# EAGLE schematic BaseBoard5 (EAGLE 6.5.0)

## Sheet 1 of 3: Power Supply
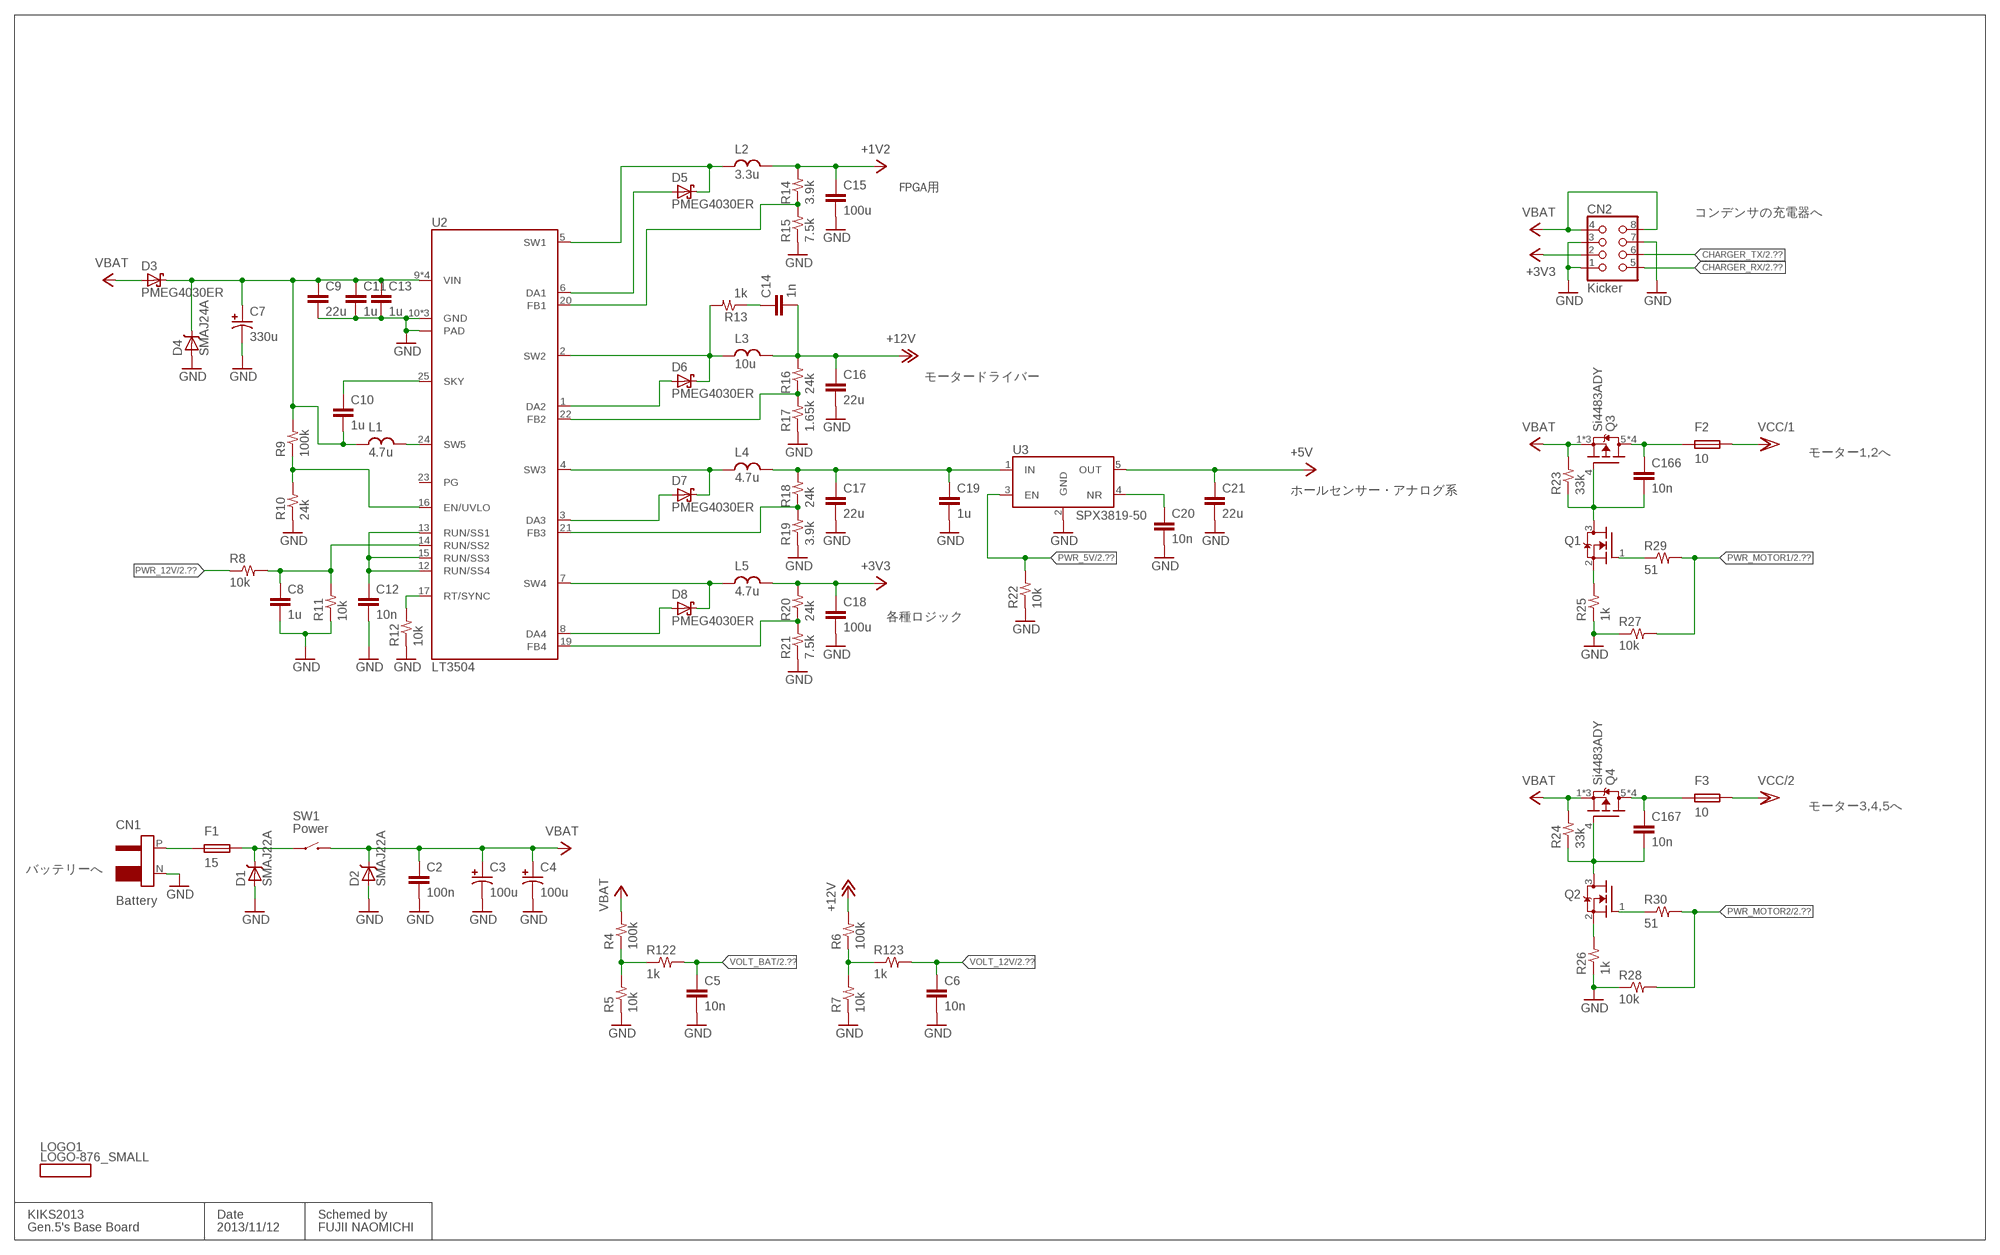
[diagram p0: schematic, sheet 1]

### Parts
C2  100n  C1608  [1608]
C3  100u  CPOLS-6.3  [ES-6.3]
C4  100u  CPOLS-6.3  [ES-6.3]
C5  10n  C1005  [1005]
C6  10n  C1005  [1005]
C7  330u  CPOLS2-8  [ES2-8]
C8  1u  C1005  [1005]
C9  22u  C3225  [3225]
C10  1u  C1608  [1608]
C11  1u  C1608  [1608]
C12  10n  C1005  [1005]
C13  1u  C1608  [1608]
C14  1n  C1005  [1005]
C15  100u  C3225  [3225]
C16  22u  C3225  [3225]
C17  22u  C3216  [3216]
C18  100u  C3225  [3225]
C19  1u  C1005  [1005]
C20  10n  C1005  [1005]
C21  22u  C3216  [3216]
C166  10n  C1005  [1005]
C167  10n  C1005  [1005]
CN1  Battery  T-CON  [T-CON]
CN2  Kicker  43045-0800  [43045-0800]
D1  SMAJ22A  ZENER-DO-214AC  [DO-214AC]
D2  SMAJ22A  ZENER-DO-214AC  [DO-214AC]
D3  PMEG4030ER  SBD-SDO123W  [SOD123W]
D4  SMAJ24A  ZENER-DO-214AC  [DO-214AC]
D5  PMEG4030ER  SBD-SDO123W  [SOD123W]
D6  PMEG4030ER  SBD-SDO123W  [SOD123W]
D7  PMEG4030ER  SBD-SDO123W  [SOD123W]
D8  PMEG4030ER  SBD-SDO123W  [SOD123W]
F1  15  F3216  [3216]
F2  10  F3216  [3216]
F3  10  F3216  [3216]
L1  4.7u  L2520  [L2520]
L2  3.3u  L2520  [L2520]
L3  10u  L40  [L4040]
L4  4.7u  L2520  [L2520]
L5  4.7u  L2520  [L2520]
LOGO1  LOGO-876_SMALL  [LOGO-876_SMALL]
Q1  MOS-N-SOT23  [SOT23-3]
Q2  MOS-N-SOT23  [SOT23-3]
Q3  Si4483ADY  MOS-P-SOP8  [SOP8]
Q4  Si4483ADY  MOS-P-SOP8  [SOP8]
R4  100k  R1608  [1608]
R5  10k  R1608  [1608]
R6  100k  R1608  [1608]
R7  10k  R1608  [1608]
R8  10k  R1005  [1005]
R9  100k  R1608  [1608]
R10  24k  R1608  [1608]
R11  10k  R1005  [1005]
R12  10k  R1005  [1005]
R13  1k  R1005  [1005]
R14  3.9k  R1608  [1608]
R15  7.5k  R1608  [1608]
R16  24k  R1608  [1608]
R17  1.65k  R1608  [1608]
R18  24k  R1608  [1608]
R19  3.9k  R1608  [1608]
R20  24k  R1608  [1608]
R21  7.5k  R1608  [1608]
R22  10k  R1005  [1005]
R23  33k  R1005  [1005]
R24  33k  R1005  [1005]
R25  1k  R1005  [1005]
R26  1k  R1005  [1005]
R27  10k  R1005  [1005]
R28  10k  R1005  [1005]
R29  51  R1005  [1005]
R30  51  R1005  [1005]
R122  1k  R1005  [1005]
R123  1k  R1005  [1005]
SW1  Power  SLE6A4  [SLE6_10A4]
U2  LT3504  [QFN28-0.5-PAD]
U3  SPX3819-50  [SOT23-5]

### Nets
+1V2: C15.1 L2.2 R14.2 ; also sheet 2
+3V3: C18.1 CN2.2 L5.2 R20.2 ; also sheet 2,3
+5V: C21.1 U3.5(OUT) ; also sheet 2,3
+12V: C14.2 C16.1 L3.2 R6.2 R16.2 ; also sheet 3
CHARGER_RX: CN2.5 ; also sheet 2
CHARGER_TX: CN2.6 ; also sheet 2
GND: C2.2 C3.N C4.N C5.2 C6.2 C7.N C8.2 C9.2 C11.2 C12.2 C13.2 C15.2 C16.2 C17.2 C18.2 C19.2 C20.2 C21.2 CN1.N CN2.1 CN2.3 CN2.7 D1.A D2.A D4.A R5.1 R7.1 R10.1 R11.1 R12.1 R15.1 R17.1 R19.1 R21.1 R22.1 R25.1 R26.1 R27.1 R28.1 U2.10(GND) U2.18(GND) U2.27(GND) U2.PAD U3.2(GND) ; also sheet 2,3
N$1: C8.1 R8.2 R11.2 U2.14(RUN/SS2)
N$3: C10.1 U2.25(SKY)
N$4: L1.2 U2.24(SW5)
N$5: C12.1 U2.12(RUN/SS4) U2.13(RUN/SS1) U2.15(RUN/SS3)
N$6: D8.A U2.8(DA4)
N$7: D7.A U2.3(DA3)
N$8: D8.K L5.1 U2.7(SW4)
N$9: R12.2 U2.17(RT/SYNC)
N$10: D6.A U2.1(DA2)
N$12: D5.K L2.1 U2.5(SW1)
N$13: R18.1 R19.2 U2.21(FB3)
N$14: D6.K L3.1 R13.2 U2.2(SW2)
N$15: D7.K L4.1 U2.4(SW3)
N$16: R9.1 R10.2 U2.16(EN/UVLO)
N$17: R20.1 R21.2 U2.19(FB4)
N$18: R14.1 R15.2 U2.20(FB1)
N$19: R16.1 R17.2 U2.22(FB2)
N$21: C17.1 C19.1 L4.2 R18.2 U3.1(IN)
N$23: C166.1 F2.1 Q3.5(D) Q3.6(D) Q3.7(D) Q3.8(D)
N$25: C166.2 Q1.3(D) Q3.4(G) R23.1
N$26: C14.1 R13.1
N$31: C7.P C9.1 C10.2 C11.1 C13.1 D3.K D4.K L1.1 R9.2 U2.9(VIN) U2.11(VIN) U2.26(VIN) U2.28(VIN)
N$36: Q1.2(S) R25.2
N$39: C167.1 F3.1 Q4.5(D) Q4.6(D) Q4.7(D) Q4.8(D)
N$44: D5.A U2.6(DA1)
N$45: C167.2 Q2.3(D) Q4.4(G) R24.1
N$46: Q2.1(G) R30.1
N$47: Q1.1(G) R29.1
N$60: C20.1 U3.4(NR)
N$89: CN1.P F1.1
N$170: Q2.2(S) R26.2
N$172: D1.K F1.2 SW1.P(A)
N$175: R4.1 R5.2 R122.1
N$176: R6.1 R7.2 R123.1
PWR_5V: R22.2 U3.3(EN) ; also sheet 2
PWR_12V: R8.1 ; also sheet 2
PWR_MOTOR1: R27.2 R29.2 ; also sheet 2
PWR_MOTOR2: R28.2 R30.2 ; also sheet 2
VBAT: C2.1 C3.P C4.P CN2.4 CN2.8 D2.K D3.A Q3.1(S) Q3.2(S) Q3.3(S) Q4.1(S) Q4.2(S) Q4.3(S) R4.2 R23.2 R24.2 SW1.1(B)
VCC/1: F2.2 ; also sheet 3
VCC/2: F3.2 ; also sheet 3
VOLT_12V: C6.1 R123.2 ; also sheet 2
VOLT_BAT: C5.1 R122.2 ; also sheet 2
Unconnected: U2.23(PG)

### Notes on the sheet
- FPGA用
- コンデンサの充電器へ
- モータードライバー
- モーター1,2へ
- ホールセンサー・アナログ系
- 各種ロジック
- モーター3,4,5へ
- バッテリーへ
- KIKS2013 | Date | Schemed by
- Gen.5's Base Board | 2013/11/12 | FUJII NAOMICHI

## Sheet 2 of 3: Logic
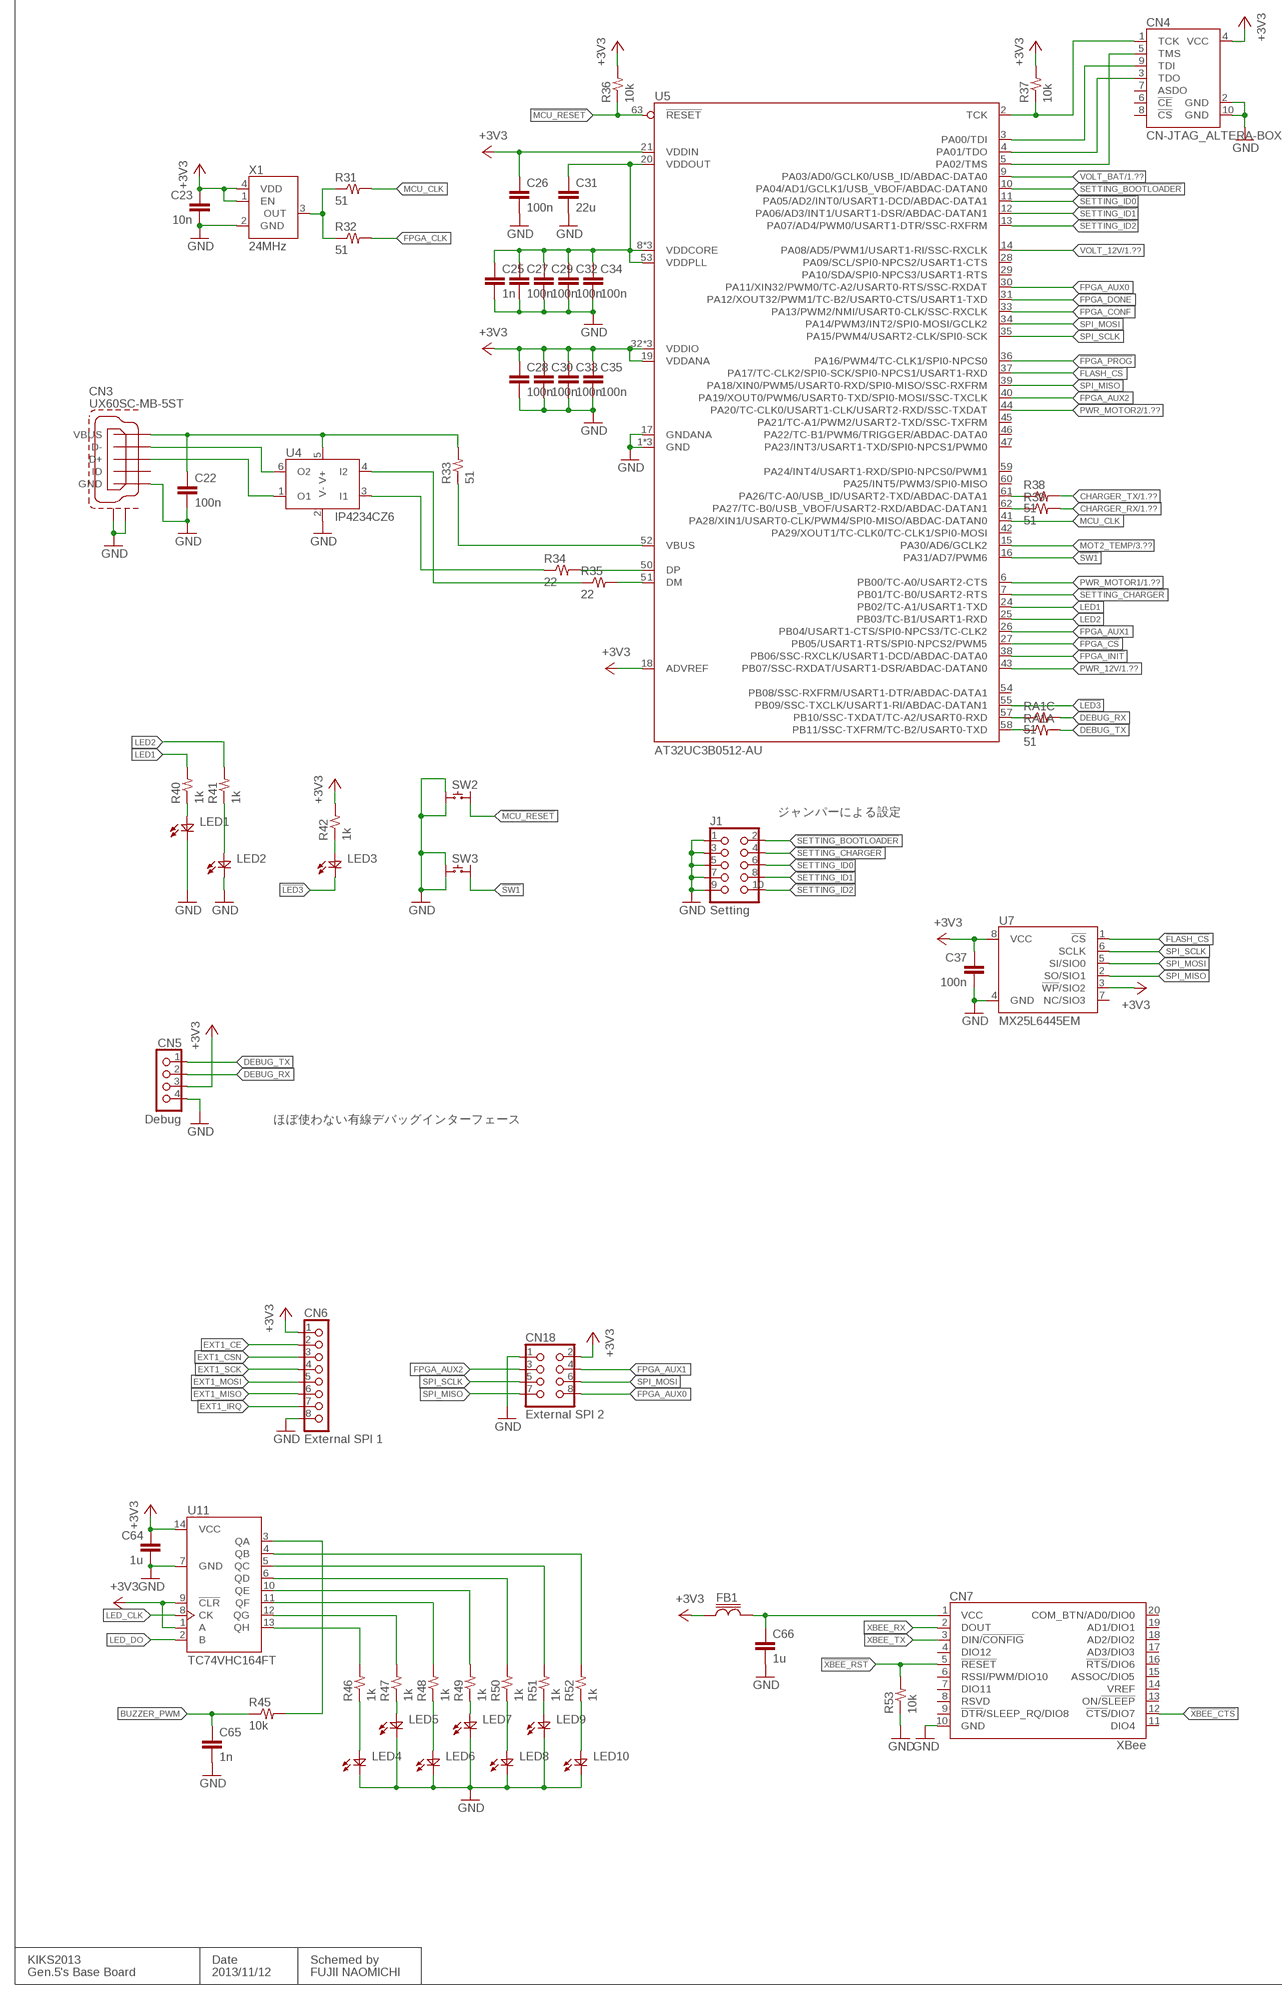
[diagram p1: schematic, sheet 2, part 1 of 2]
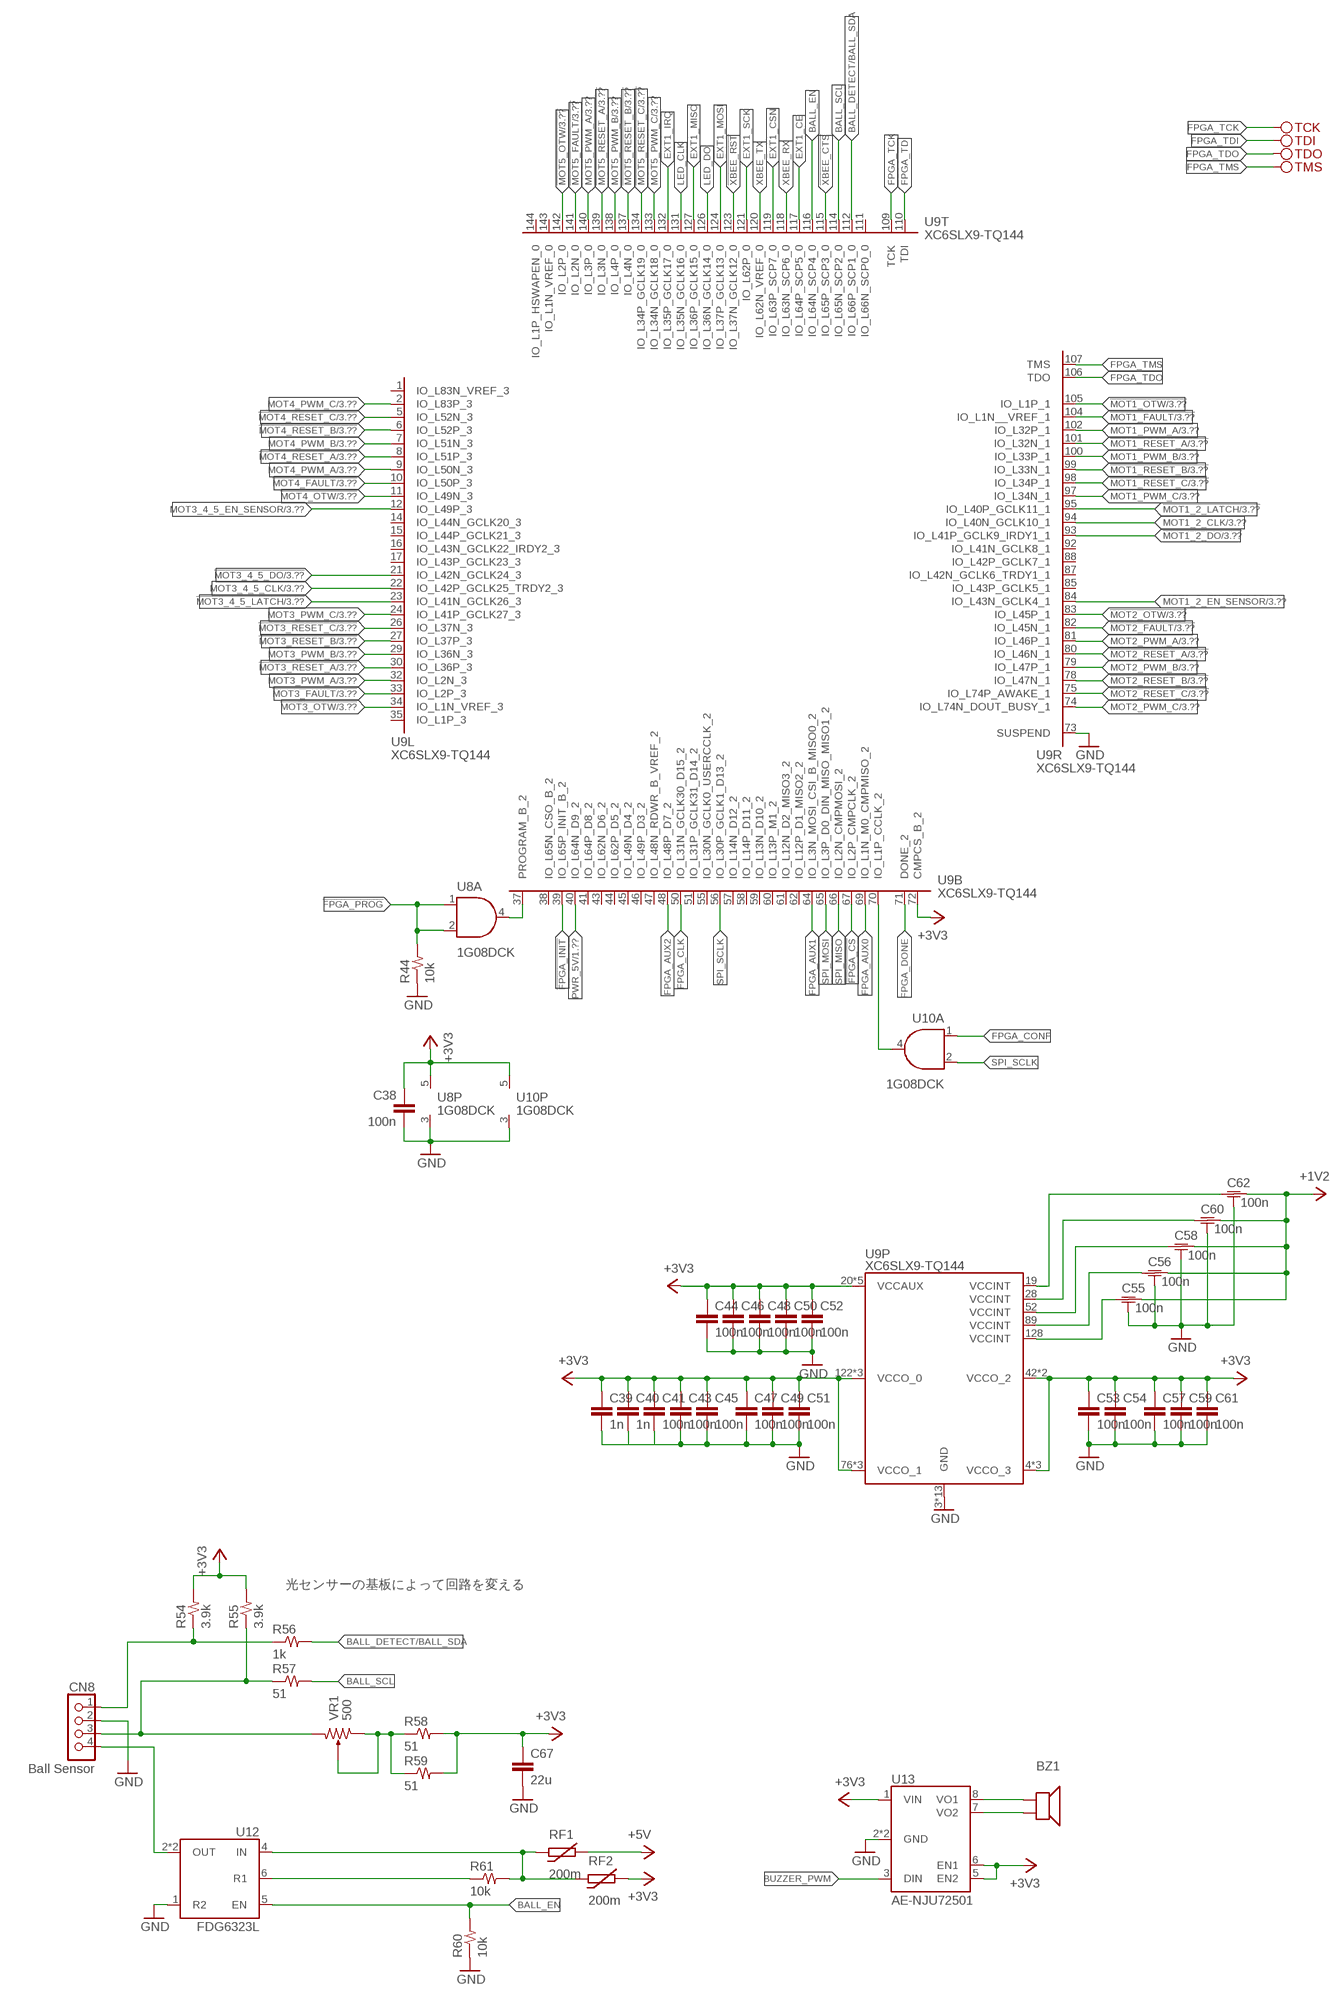
[diagram p2: schematic, sheet 2, part 2 of 2]

### Parts
BZ1  PKLCS1212E4001  [PKLCS1212]
C22  100n  C1005  [1005]
C23  10n  C1005  [1005]
C25  1n  C1005  [1005]
C26  100n  C1005  [1005]
C27  100n  C1005  [1005]
C28  100n  C1005  [1005]
C29  100n  C1005  [1005]
C30  100n  C1005  [1005]
C31  22u  C2012  [2012]
C32  100n  C1005  [1005]
C33  100n  C1005  [1005]
C34  100n  C1005  [1005]
C35  100n  C1005  [1005]
C37  100n  C1005  [1005]
C38  100n  C1005  [1005]
C39  1n  C1005  [1005]
C40  1n  C1005  [1005]
C41  100n  C1005  [1005]
C43  100n  C1005  [1005]
C44  100n  C1005  [1005]
C45  100n  C1005  [1005]
C46  100n  C1005  [1005]
C47  100n  C1005  [1005]
C48  100n  C1005  [1005]
C49  100n  C1005  [1005]
C50  100n  C1005  [1005]
C51  100n  C1005  [1005]
C52  100n  C1005  [1005]
C53  100n  C1005  [1005]
C54  100n  C1005  [1005]
C55  100n  CT1608  [NFM18]
C56  100n  CT1608  [NFM18]
C57  100n  C1005  [1005]
C58  100n  CT1608  [NFM18]
C59  100n  C1005  [1005]
C60  100n  CT1608  [NFM18]
C61  100n  C1005  [1005]
C62  100n  CT1608  [NFM18]
C64  1u  C1005  [1005]
C65  1n  C1005  [1005]
C66  1u  C1608  [1608]
C67  22u  C2012  [2012]
CN3  UX60SC-MB-5ST  [UX60SC-MB-5ST]
CN4  CN-JTAG_ALTERA-BOX  [PIN2X5-BOX]
CN5  Debug  70553-0003  [70553-0003]
CN6  External SPI 1  PIN1X8  [PIN1X8]
CN7  XBee  XBEE-TH  [XBEE-TH]
CN8  Ball Sensor  53375-0410  [53375-04]
CN18  External SPI 2  PIN2X4  [PIN2X4]
FB1  FB1608  [1608]
J1  Setting  PIN2X5-2.0  [PIN2X5-2.0]
LED1  LED1608  [1608]
LED2  LED1608  [1608]
LED3  LED1608  [1608]
LED4  LED1608  [1608]
LED5  LED1608  [1608]
LED6  LED1608  [1608]
LED7  LED1608  [1608]
LED8  LED1608  [1608]
LED9  LED1608  [1608]
LED10  LED1608  [1608]
P1  TCK  PAD  [PAD]
P2  TDI  PAD  [PAD]
P3  TDO  PAD  [PAD]
P4  TMS  PAD  [PAD]
R31  51  R1005  [1005]
R32  51  R1005  [1005]
R33  51  R1005  [1005]
R34  22  R1005  [1005]
R35  22  R1005  [1005]
R36  10k  R1005  [1005]
R37  10k  R1005  [1005]
R38  51  R1005  [1005]
R39  51  R1005  [1005]
R40  1k  R1005  [1005]
R41  1k  R1005  [1005]
R42  1k  R1005  [1005]
R44  10k  R1005  [1005]
R45  10k  R1005  [1005]
R46  1k  R1005  [1005]
R47  1k  R1005  [1005]
R48  1k  R1005  [1005]
R49  1k  R1005  [1005]
R50  1k  R1005  [1005]
R51  1k  R1005  [1005]
R52  1k  R1005  [1005]
R53  10k  R1005  [1005]
R54  3.9k  R1608  [1608]
R55  3.9k  R1608  [1608]
R56  1k  R1005  [1005]
R57  51  R1005  [1005]
R58  51  R1005  [1005]
R59  51  R1005  [1005]
R60  10k  R1005  [1005]
R61  10k  R1005  [1005]
RA1  51  RA4  [1005-A4]
RF1  200m  RF2012  [2012]
RF2  200m  RF2012  [2012]
SW2  EVQ-P2-RECTANGLE  [EVQ-P2_P9]
SW3  EVQ-P2-RECTANGLE  [EVQ-P2_P9]
U4  IP4234CZ6  TPD2S017  [SOT23-6]
U5  AT32UC3B0512-AU  [QFP64-0.5]
U7  MX25L6445EM  [SOP8W]
U8  1G08DCK  [SC70-5]
U9  XC6SLX9-TQ144  [QFP144-0.5]
U10  1G08DCK  [SC70-5]
U11  TC74VHC164FT  [TSSOP14]
U12  FDG6323L  [SC70-6]
U13  AE-NJU72501  [AE-NJU72501]
VR1  500  VR  [VR]
X1  24MHz  ASDMB  [OSC2520]

### Nets
!FLASH_CS: U5.37(PA17/TC-CLK2/SPI0-SCK/SPI0-NPCS1/USART1-RXD) U7.1(!CS)
!FPGA_CS: U5.27(PB05/USART1-RTS/SPI0-NPCS2/PWM5) U9.67(B:IO_L2P_CMPCLK_2)
!FPGA_INIT: U5.38(PB06/SSC-RXCLK/USART1-DCD/ABDAC-DATA0) U9.39(B:IO_L65P_INIT_B_2)
!FPGA_PROG: R44.2 U5.36(PA16/PWM4/TC-CLK1/SPI0-NPCS0) U8.1(A:A) U8.2(A:B)
!LED3: LED3.K U5.55(PB09/SSC-TXCLK/USART1-RI/ABDAC-DATAN1)
!MCU_RESET: R36.1 SW2.B2 U5.63(!RESET)
!MOT1_2_DO: U9.93(R:IO_L41P_GCLK9_IRDY1_1) ; also sheet 3
!MOT1_2_LATCH: U9.95(R:IO_L40P_GCLK11_1) ; also sheet 3
!MOT1_FAULT: U9.104(R:IO_L1N__VREF_1) ; also sheet 3
!MOT1_OTW: U9.105(R:IO_L1P_1) ; also sheet 3
!MOT1_RESET_A: U9.101(R:IO_L32N_1) ; also sheet 3
!MOT1_RESET_B: U9.99(R:IO_L33N_1) ; also sheet 3
!MOT1_RESET_C: U9.98(R:IO_L34P_1) ; also sheet 3
!MOT2_FAULT: U9.82(R:IO_L45N_1) ; also sheet 3
!MOT2_OTW: U9.83(R:IO_L45P_1) ; also sheet 3
!MOT2_RESET_A: U9.80(R:IO_L46N_1) ; also sheet 3
!MOT2_RESET_B: U9.78(R:IO_L47N_1) ; also sheet 3
!MOT2_RESET_C: U9.75(R:IO_L74P_AWAKE_1) ; also sheet 3
!MOT3_4_5_DO: U9.21(L:IO_L42N_GCLK24_3) ; also sheet 3
!MOT3_4_5_LATCH: U9.23(L:IO_L41N_GCLK26_3) ; also sheet 3
!MOT3_FAULT: U9.33(L:IO_L2P_3) ; also sheet 3
!MOT3_OTW: U9.34(L:IO_L1N_VREF_3) ; also sheet 3
!MOT3_RESET_A: U9.30(L:IO_L36P_3) ; also sheet 3
!MOT3_RESET_B: U9.27(L:IO_L37P_3) ; also sheet 3
!MOT3_RESET_C: U9.26(L:IO_L37N_3) ; also sheet 3
!MOT4_FAULT: U9.10(L:IO_L50P_3) ; also sheet 3
!MOT4_OTW: U9.11(L:IO_L49N_3) ; also sheet 3
!MOT4_RESET_A: U9.8(L:IO_L51P_3) ; also sheet 3
!MOT4_RESET_B: U9.6(L:IO_L52P_3) ; also sheet 3
!MOT4_RESET_C: U9.5(L:IO_L52N_3) ; also sheet 3
!MOT5_FAULT: U9.141(T:IO_L2N_0) ; also sheet 3
!MOT5_OTW: U9.142(T:IO_L2P_0) ; also sheet 3
!MOT5_RESET_A: U9.139(T:IO_L3N_0) ; also sheet 3
!MOT5_RESET_B: U9.137(T:IO_L4N_0) ; also sheet 3
!MOT5_RESET_C: U9.134(T:IO_L34P_GCLK19_0) ; also sheet 3
!SETTING_BOOTLOADER: J1.2 U5.10(PA04/AD1/GCLK1/USB_VBOF/ABDAC-DATAN0)
!SETTING_CHARGER: J1.4 U5.7(PB01/TC-B0/USART2-RTS)
!SETTING_ID0: J1.6 U5.11(PA05/AD2/INT0/USART1-DCD/ABDAC-DATA1)
!SETTING_ID1: J1.8 U5.12(PA06/AD3/INT1/USART1-DSR/ABDAC-DATAN1)
!SETTING_ID2: J1.10 U5.13(PA07/AD4/PWM0/USART1-DTR/SSC-RXFRM)
!SW1: SW3.B2 U5.16(PA31/AD7/PWM6)
!XBEE_CTS: CN7.12(!CTS!/DIO7) U9.115(T:IO_L65P_SCP3_0)
!XBEE_RST: CN7.5(!RESET) R53.2 U9.123(T:IO_L37N_GCLK12_0)
+1V2: C55.2 C56.2 C58.2 C60.2 C62.2 ; also sheet 1
+1V8: C25.1 C27.1 C29.1 C31.1 C32.1 C34.1 U5.8(VDDCORE) U5.20(VDDOUT) U5.22(VDDCORE) U5.53(VDDPLL) U5.56(VDDCORE)
+3V3: C23.1 C26.1 C28.1 C30.1 C33.1 C35.1 C37.1 C38.1 C39.1 C40.1 C41.1 C43.1 C44.1 C45.1 C46.1 C47.1 C48.1 C49.1 C50.1 C51.1 C52.1 C53.1 C54.1 C57.1 C59.1 C61.1 C64.1 C67.1 CN4.4(VCC) CN5.3 CN6.1 CN18.2 FB1.1 R36.2 R37.2 R42.2 R54.2 R55.2 R58.2 R59.2 RF2.2 U5.18(ADVREF) U5.19(VDDANA) U5.21(VDDIN) U5.32(VDDIO) U5.48(VDDIO) U5.64(VDDIO) U7.3(!WP!/SIO2) U7.8(VCC) U8.5(P:VCC) U9.4(P:VCCO_3) U9.18(P:VCCO_3) U9.20(P:VCCAUX) U9.31(P:VCCO_3) U9.36(P:VCCAUX) U9.42(P:VCCO_2) U9.53(P:VCCAUX) U9.63(P:VCCO_2) U9.72(B:CMPCS_B_2) U9.76(P:VCCO_1) U9.86(P:VCCO_1) U9.90(P:VCCAUX) U9.103(P:VCCO_1) U9.122(P:VCCO_0) U9.125(P:VCCO_0) U9.129(P:VCCAUX) U9.135(P:VCCO_0) U10.5(P:VCC) U11.1(A) U11.9(!CLR) U11.14(VCC) U13.1(VIN) U13.5(EN2) U13.6(EN1) X1.1(EN) X1.4(VDD) ; also sheet 1,3
+5V: RF1.2 ; also sheet 1,3
BALL_DETECT/BALL_SDA: R56.2 U9.112(T:IO_L66P_SCP1_0)
BALL_EN: R60.2 U9.116(T:IO_L64N_SCP4_0) U12.5(EN)
BALL_SCL: R57.2 U9.114(T:IO_L65N_SCP2_0)
BUZZER_PWM: C65.1 R45.1 U13.3(DIN)
CHARGER_RX: R39.2 ; also sheet 1
CHARGER_TX: R38.2 ; also sheet 1
DEBUG_RX: CN5.2 RA1.C2
DEBUG_TX: CN5.1 RA1.A2
EXT1_CE: CN6.2 U9.117(T:IO_L64P_SCP5_0)
EXT1_CSN: CN6.3 U9.119(T:IO_L63P_SCP7_0)
EXT1_IRQ: CN6.7 U9.132(T:IO_L35P_GCLK17_0)
EXT1_MISO: CN6.6 U9.127(T:IO_L36P_GCLK15_0)
EXT1_MOSI: CN6.5 U9.124(T:IO_L37P_GCLK13_0)
EXT1_SCK: CN6.4 U9.121(T:IO_L62P_0)
FPGA_AUX0: CN18.8 U5.30(PA11/XIN32/PWM0/TC-A2/USART0-RTS/SSC-RXDAT) U9.69(B:IO_L1N_M0_CMPMISO_2)
FPGA_AUX1: CN18.4 U5.26(PB04/USART1-CTS/SPI0-NPCS3/TC-CLK2) U9.64(B:IO_L3N_MOSI_CSI_B_MISO0_2)
FPGA_AUX2: CN18.3 U5.40(PA19/XOUT0/PWM6/USART0-TXD/SPI0-MOSI/SSC-TXCLK) U9.48(B:IO_L48P_D7_2)
FPGA_CLK: R32.2 U9.50(B:IO_L31N_GCLK30_D15_2)
FPGA_CONF: U5.33(PA13/PWM2/NMI/USART0-CLK/SSC-RXCLK) U10.1(A:A)
FPGA_DONE: U5.31(PA12/XOUT32/PWM1/TC-B2/USART0-CTS/USART1-TXD) U9.71(B:DONE_2)
FPGA_TCK: P1.1 U9.109(T:TCK)
FPGA_TDI: P2.1 U9.110(T:TDI)
FPGA_TDO: P3.1 U9.106(R:TDO)
FPGA_TMS: P4.1 U9.107(R:TMS)
GND: C22.2 C23.2 C25.2 C26.2 C27.2 C28.2 C29.2 C30.2 C31.2 C32.2 C33.2 C34.2 C35.2 C37.2 C38.2 C39.2 C40.2 C41.2 C43.2 C44.2 C45.2 C46.2 C47.2 C48.2 C49.2 C50.2 C51.2 C52.2 C53.2 C54.2 C55.GND C56.GND C57.2 C58.GND C59.2 C60.GND C61.2 C62.GND C64.2 C65.2 C66.2 C67.2 CN3.5(GND) CN3.S1 CN3.S2 CN4.2(GND) CN4.10(GND) CN5.4 CN6.8 CN7.10(GND) CN8.2 CN18.1 J1.1 J1.3 J1.5 J1.7 J1.9 LED1.K LED2.K LED4.K LED5.K LED6.K LED7.K LED8.K LED9.K LED10.K R44.1 R53.1 R60.1 SW2.A1 SW2.A2 SW3.A1 SW3.A2 U4.2(V-) U5.1(GND) U5.17(GNDANA) U5.23(GND) U5.49(GND) U7.4(GND) U8.3(P:GND) U9.3(P:GND) U9.13(P:GND) U9.25(P:GND) U9.49(P:GND) U9.54(P:GND) U9.68(P:GND) U9.73(R:SUSPEND) U9.77(P:GND) U9.91(P:GND) U9.96(P:GND) U9.108(P:GND) U9.113(P:GND) U9.130(P:GND) U9.136(P:GND) U10.3(P:GND) U11.7(GND) U12.1(R2) U13.2(GND) U13.4(GND) X1.2(GND) ; also sheet 1,3
LED1: R40.2 U5.24(PB02/TC-A1/USART1-TXD)
LED2: R41.2 U5.25(PB03/TC-B1/USART1-RXD)
LED_CLK: U9.131(T:IO_L35N_GCLK16_0) U11.8(CK)
LED_DO: U9.126(T:IO_L36N_GCLK14_0) U11.2(B)
MCU_CLK: R31.2 U5.41(PA28/XIN1/USART0-CLK/PWM4/SPI0-MISO/ABDAC-DATAN0)
MOT1_2_CLK: U9.94(R:IO_L40N_GCLK10_1) ; also sheet 3
MOT1_2_EN_SENSOR: U9.84(R:IO_L43N_GCLK4_1) ; also sheet 3
MOT1_PWM_A: U9.102(R:IO_L32P_1) ; also sheet 3
MOT1_PWM_B: U9.100(R:IO_L33P_1) ; also sheet 3
MOT1_PWM_C: U9.97(R:IO_L34N_1) ; also sheet 3
MOT2_PWM_A: U9.81(R:IO_L46P_1) ; also sheet 3
MOT2_PWM_B: U9.79(R:IO_L47P_1) ; also sheet 3
MOT2_PWM_C: U9.74(R:IO_L74N_DOUT_BUSY_1) ; also sheet 3
MOT2_TEMP: U5.15(PA30/AD6/GCLK2) ; also sheet 3
MOT3_4_5_CLK: U9.22(L:IO_L42P_GCLK25_TRDY2_3) ; also sheet 3
MOT3_4_5_EN_SENSOR: U9.12(L:IO_L49P_3) ; also sheet 3
MOT3_PWM_A: U9.32(L:IO_L2N_3) ; also sheet 3
MOT3_PWM_B: U9.29(L:IO_L36N_3) ; also sheet 3
MOT3_PWM_C: U9.24(L:IO_L41P_GCLK27_3) ; also sheet 3
MOT4_PWM_A: U9.9(L:IO_L50N_3) ; also sheet 3
MOT4_PWM_B: U9.7(L:IO_L51N_3) ; also sheet 3
MOT4_PWM_C: U9.2(L:IO_L83P_3) ; also sheet 3
MOT5_PWM_A: U9.140(T:IO_L3P_0) ; also sheet 3
MOT5_PWM_B: U9.138(T:IO_L4P_0) ; also sheet 3
MOT5_PWM_C: U9.133(T:IO_L34N_GCLK18_0) ; also sheet 3
N$2: R39.1 U5.62(PA27/TC-B0/USB_VBOF/USART2-RXD/ABDAC-DATAN1)
N$11: R34.2 U5.50(DP)
N$22: CN3.2(D-) U4.6(O2)
N$29: LED1.A R40.1
N$30: LED2.A R41.1
N$32: R35.2 U5.51(DM)
N$33: R35.1 U4.4(I2)
N$34: R34.1 U4.3(I1)
N$38: LED3.A R42.1
N$40: CN4.1(TCK) R37.1 U5.2(TCK)
N$41: C66.1 CN7.1(VCC) FB1.2
N$42: RA1.C1 U5.57(PB10/SSC-TXDAT/TC-A2/USART0-RXD)
N$48: R33.1 U5.52(VBUS)
N$50: BZ1.1 U13.8(VO1)
N$51: CN4.9(TDI) U5.3(PA00/TDI)
N$52: CN4.3(TDO) U5.4(PA01/TDO)
N$53: CN4.5(TMS) U5.5(PA02/TMS)
N$54: R31.1 R32.1 X1.3(OUT)
N$55: U8.4(A:Y) U9.37(B:PROGRAM_B_2)
N$56: U9.70(B:IO_L1P_CCLK_2) U10.4(A:Y)
N$90: BZ1.2 U13.7(VO2)
N$119: CN3.3(D+) U4.1(O1)
N$138: CN8.1 R54.1 R56.1
N$139: CN8.3 R55.1 R57.1 VR1.A
N$140: CN8.4 U12.2(OUT) U12.3(OUT)
N$141: R58.1 R59.1 VR1.B VR1.W
N$146: LED4.A R46.1
N$147: R61.1 U12.6(R1)
N$148: LED7.A R49.1
N$149: LED6.A R48.1
N$150: LED5.A R47.1
N$151: R61.2 RF1.1 RF2.1 U12.4(IN)
N$152: R47.2 U11.12(QG)
N$153: LED8.A R50.1
N$154: LED9.A R51.1
N$155: LED10.A R52.1
N$156: R48.2 U11.11(QF)
N$157: R49.2 U11.10(QE)
N$158: R46.2 U11.13(QH)
N$159: R50.2 U11.6(QD)
N$160: R51.2 U11.5(QC)
N$161: R52.2 U11.4(QB)
N$162: R45.2 U11.3(QA)
N$163: C62.1 U9.19(P:VCCINT)
N$164: C60.1 U9.28(P:VCCINT)
N$165: C58.1 U9.52(P:VCCINT)
N$166: C56.1 U9.89(P:VCCINT)
N$167: C55.1 U9.128(P:VCCINT)
N$168: RA1.A1 U5.58(PB11/SSC-TXFRM/TC-B2/USART0-TXD)
N$169: R38.1 U5.61(PA26/TC-A0/USB_ID/USART2-TXD/ABDAC-DATA1)
N$173: C22.1 CN3.1(VBUS) R33.2 U4.5(V+)
PWR_5V: U9.40(B:IO_L64N_D9_2) ; also sheet 1
PWR_12V: U5.43(PB07/SSC-RXDAT/USART1-DSR/ABDAC-DATAN0) ; also sheet 1
PWR_MOTOR1: U5.6(PB00/TC-A0/USART2-CTS) ; also sheet 1
PWR_MOTOR2: U5.44(PA20/TC-CLK0/USART1-CLK/USART2-RXD/SSC-TXDAT) ; also sheet 1
SPI_MISO: CN18.7 U5.39(PA18/XIN0/PWM5/USART0-RXD/SPI0-MISO/SSC-RXFRM) U7.2(SO/SIO1) U9.66(B:IO_L2N_CMPMOSI_2)
SPI_MOSI: CN18.6 U5.34(PA14/PWM3/INT2/SPI0-MOSI/GCLK2) U7.5(SI/SIO0) U9.65(B:IO_L3P_D0_DIN_MISO_MISO1_2)
SPI_SCLK: CN18.5 U5.35(PA15/PWM4/USART2-CLK/SPI0-SCK) U7.6(SCLK) U9.56(B:IO_L30P_GCLK1_D13_2) U10.2(A:B)
VOLT_12V: U5.14(PA08/AD5/PWM1/USART1-RI/SSC-RXCLK) ; also sheet 1
VOLT_BAT: U5.9(PA03/AD0/GCLK0/USB_ID/ABDAC-DATA0) ; also sheet 1
XBEE_RX: CN7.2(DOUT) U9.118(T:IO_L63N_SCP6_0)
XBEE_TX: CN7.3(DIN/!CONFIG) U9.120(T:IO_L62N_VREF_0)
Unconnected: CN3.4(ID) CN4.6(!CE) CN4.7(ASDO) CN4.8(!CS) CN7.4(DIO12) CN7.6(RSSI/PWM/DIO10) CN7.7(DIO11) CN7.8(RSVD) CN7.9(!DTR!/SLEEP_RQ/DIO8) CN7.11(DIO4) CN7.13(ON/!SLEEP) CN7.14(VREF) CN7.15(ASSOC/DIO5) CN7.16(!RTS!/DIO6) CN7.17(AD3/DIO3) CN7.18(AD2/DIO2) CN7.19(AD1/DIO1) CN7.20(COM_BTN/AD0/DIO0) RA1.B1 RA1.B2 RA1.D1 RA1.D2 SW2.B1 SW3.B1 U5.28(PA09/SCL/SPI0-NPCS2/USART1-CTS) U5.29(PA10/SDA/SPI0-NPCS3/USART1-RTS) U5.42(PA29/XOUT1/TC-CLK0/TC-CLK1/SPI0-MOSI) U5.45(PA21/TC-A1/PWM2/USART2-TXD/SSC-TXFRM) U5.46(PA22/TC-B1/PWM6/TRIGGER/ABDAC-DATA0) U5.47(PA23/INT3/USART1-TXD/SPI0-NPCS1/PWM0) U5.54(PB08/SSC-RXFRM/USART1-DTR/ABDAC-DATA1) U5.59(PA24/INT4/USART1-RXD/SPI0-NPCS0/PWM1) U5.60(PA25/INT5/PWM3/SPI0-MISO) U7.7(NC/SIO3) U9.1(L:IO_L83N_VREF_3) U9.14(L:IO_L44N_GCLK20_3) U9.15(L:IO_L44P_GCLK21_3) U9.16(L:IO_L43N_GCLK22_IRDY2_3) U9.17(L:IO_L43P_GCLK23_3) U9.35(L:IO_L1P_3) U9.38(B:IO_L65N_CSO_B_2) U9.41(B:IO_L64P_D8_2) U9.43(B:IO_L62N_D6_2) U9.44(B:IO_L62P_D5_2) U9.45(B:IO_L49N_D4_2) U9.46(B:IO_L49P_D3_2) U9.47(B:IO_L48N_RDWR_B_VREF_2) U9.51(B:IO_L31P_GCLK31_D14_2) U9.55(B:IO_L30N_GCLK0_USERCCLK_2) U9.57(B:IO_L14N_D12_2) U9.58(B:IO_L14P_D11_2) U9.59(B:IO_L13N_D10_2) U9.60(B:IO_L13P_M1_2) U9.61(B:IO_L12N_D2_MISO3_2) U9.62(B:IO_L12P_D1_MISO2_2) U9.85(R:IO_L43P_GCLK5_1) U9.87(R:IO_L42N_GCLK6_TRDY1_1) U9.88(R:IO_L42P_GCLK7_1) U9.92(R:IO_L41N_GCLK8_1) U9.111(T:IO_L66N_SCP0_0) U9.143(T:IO_L1N_VREF_0) U9.144(T:IO_L1P_HSWAPEN_0)

### Notes on the sheet
- ジャンパーによる設定
- ほぼ使わない有線デバッグインターフェース
- 光センサーの基板によって回路を変える
- KIKS2013 | Date | Schemed by
- Gen.5's Base Board | 2013/11/12 | FUJII NAOMICHI

## Sheet 3 of 3: Motor Driver
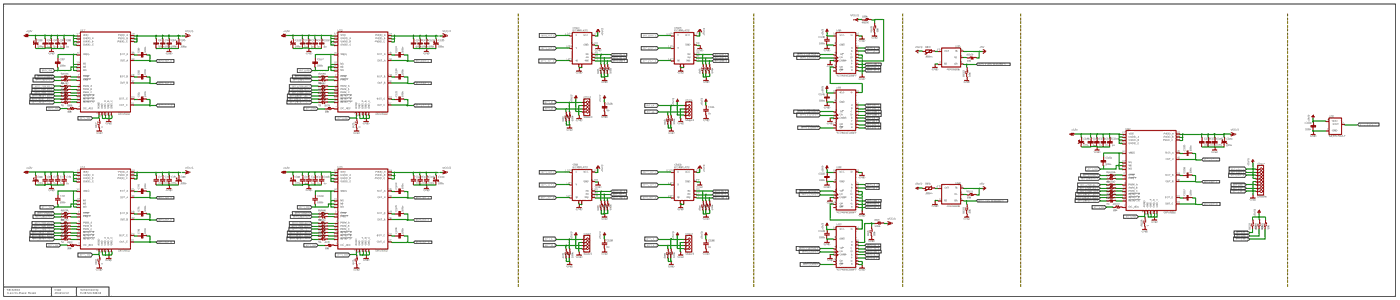
[diagram p3: schematic, sheet 3, overview]
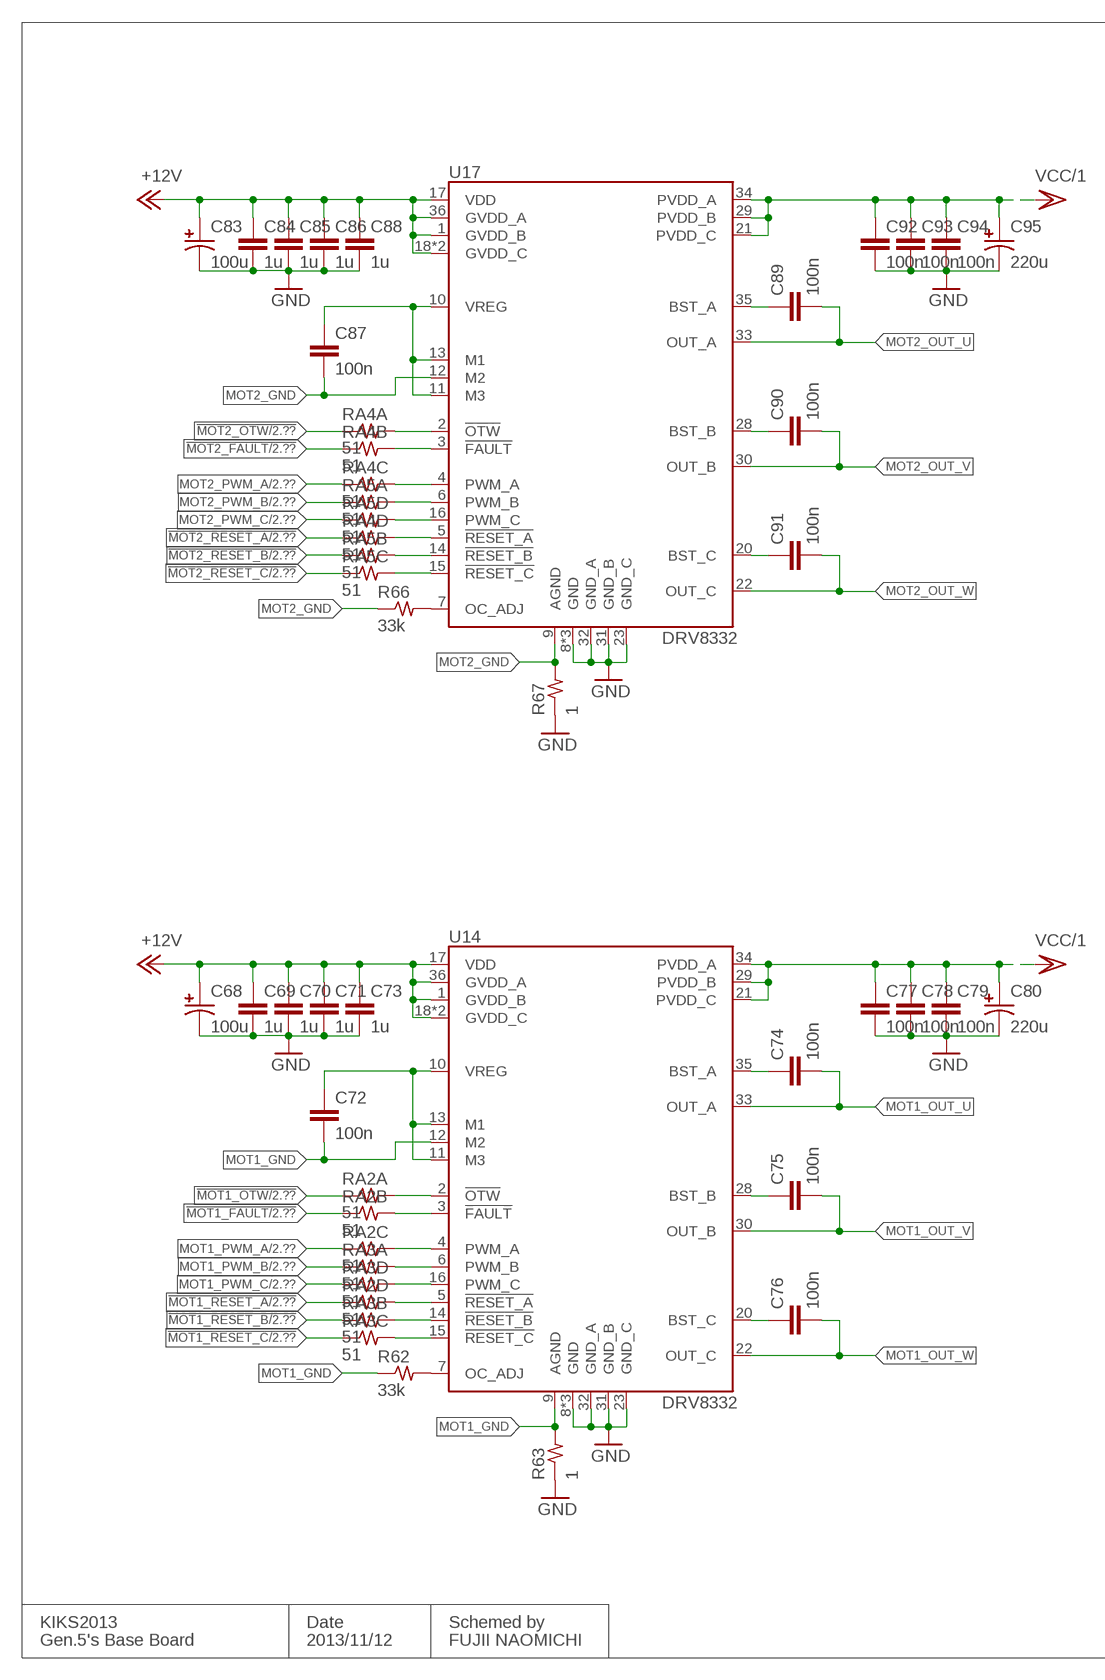
[diagram p4: schematic, sheet 3, part 1 of 4]
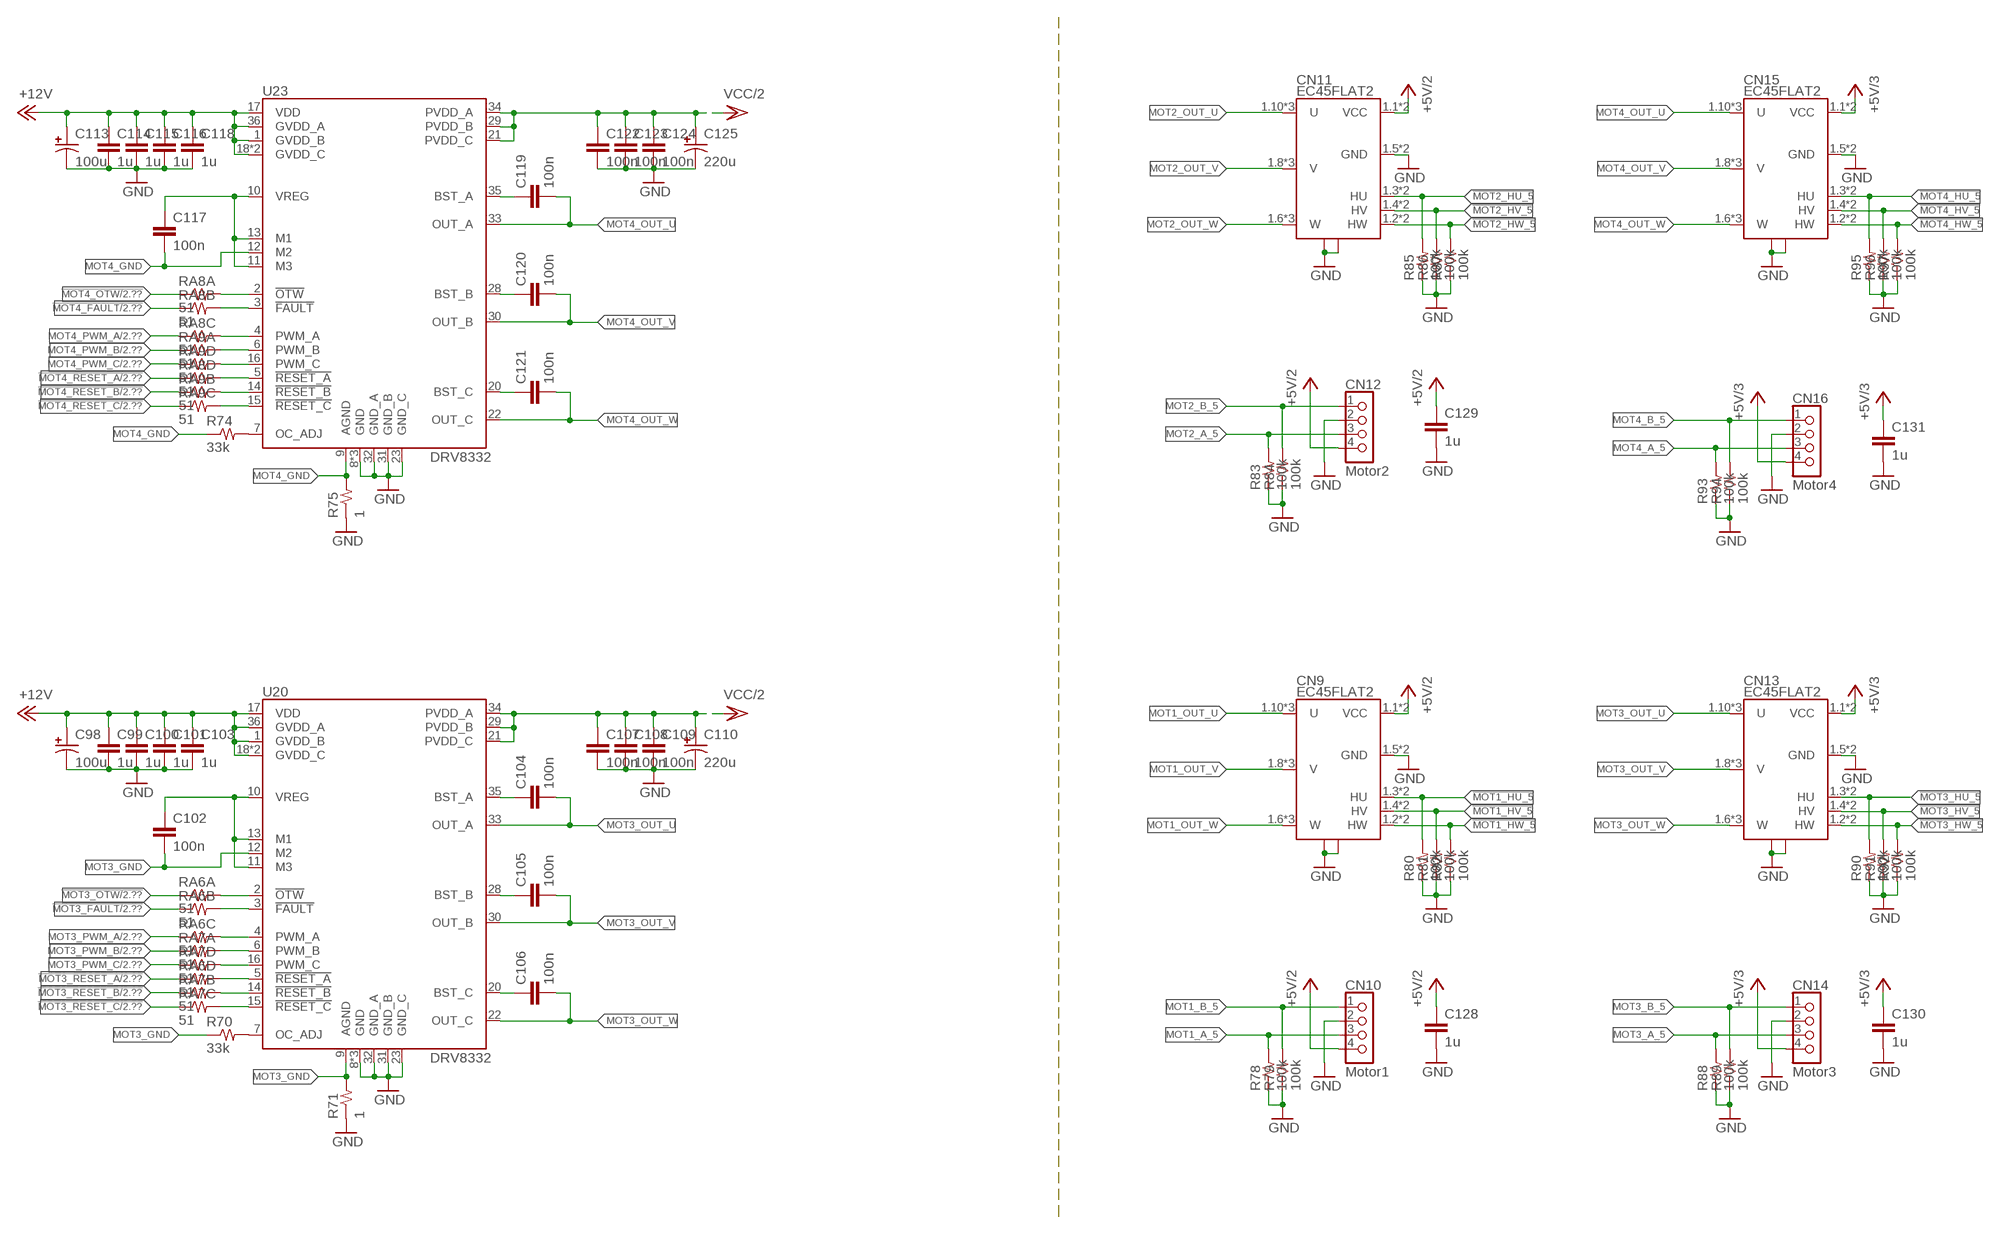
[diagram p5: schematic, sheet 3, part 2 of 4]
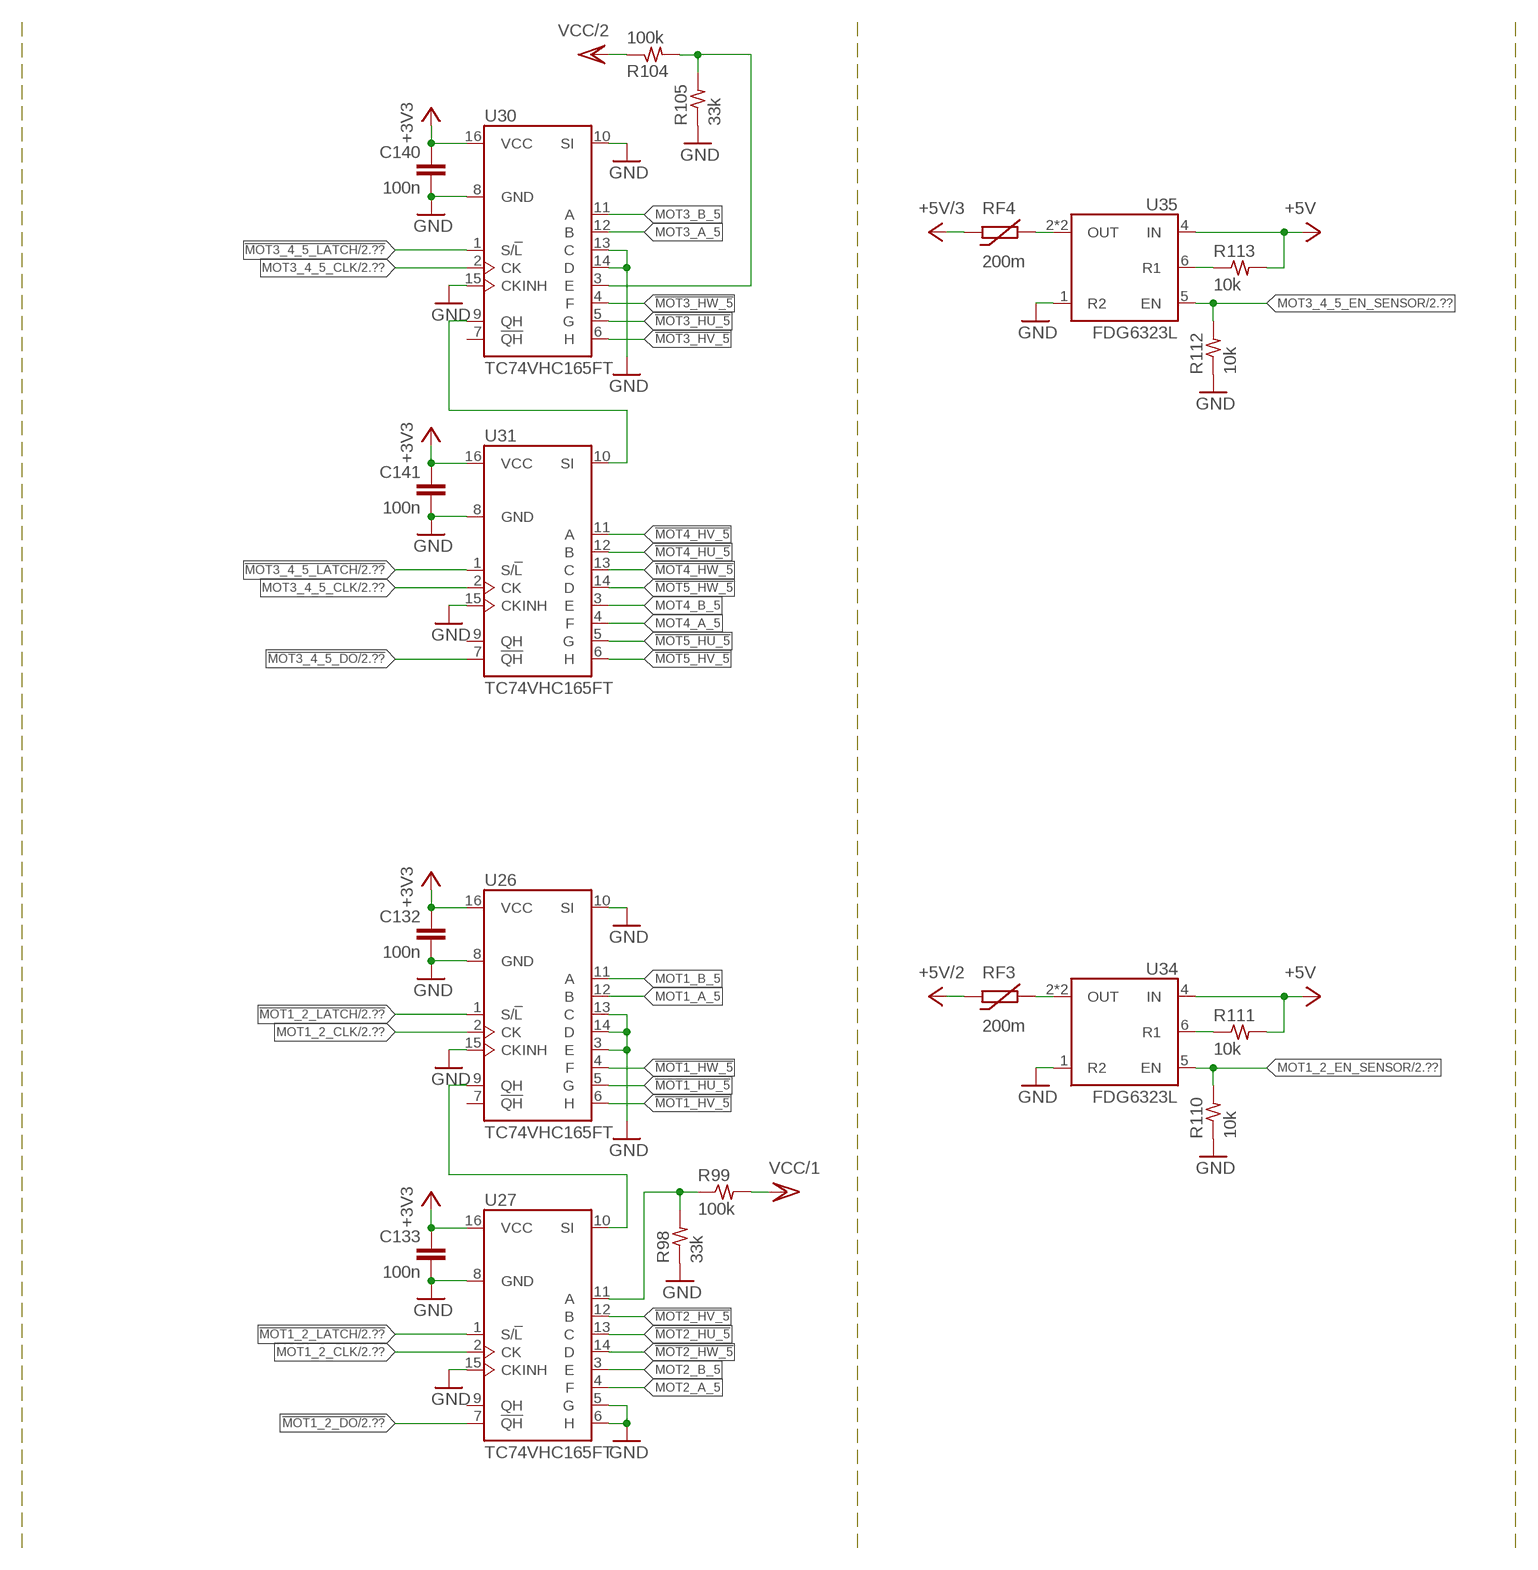
[diagram p6: schematic, sheet 3, part 3 of 4]
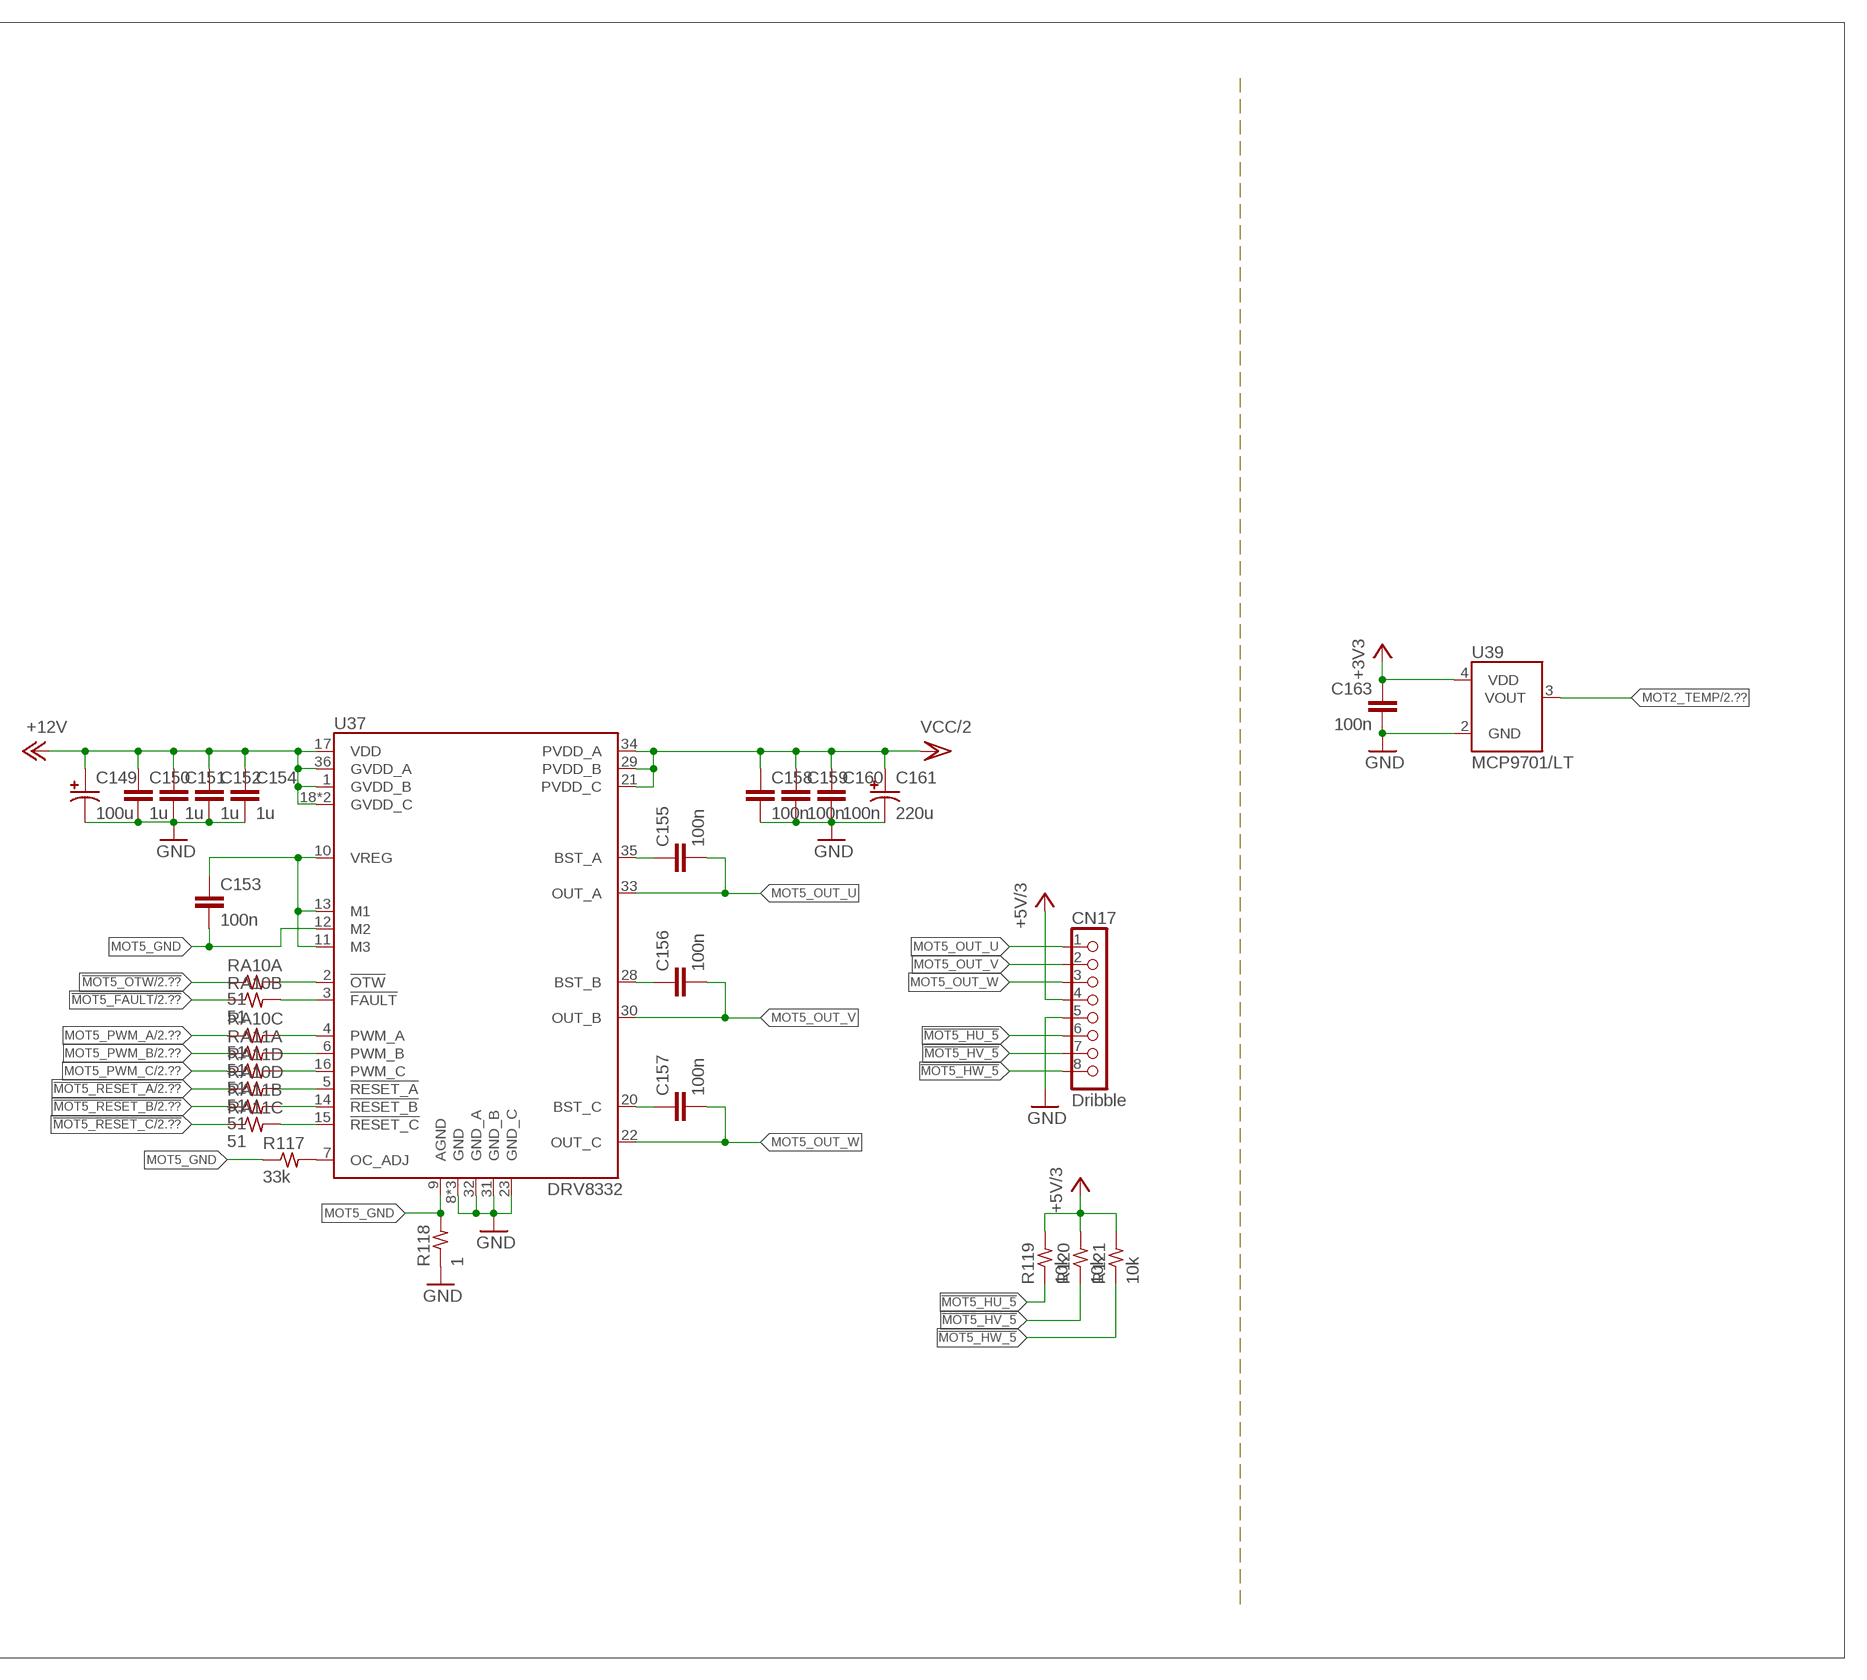
[diagram p7: schematic, sheet 3, part 4 of 4]

### Parts
C68  100u  CPOL2.5-6.3  [E2.5-6.3]
C69  1u  C1608  [1608]
C70  1u  C1608  [1608]
C71  1u  C1608  [1608]
C72  100n  C1005  [1005]
C73  1u  C1608  [1608]
C74  100n  C1608  [1608]
C75  100n  C1608  [1608]
C76  100n  C1608  [1608]
C77  100n  C1608  [1608]
C78  100n  C1608  [1608]
C79  100n  C1608  [1608]
C80  220u  CPOL3.5-8  [E3.5-8]
C83  100u  CPOL2.5-6.3  [E2.5-6.3]
C84  1u  C1608  [1608]
C85  1u  C1608  [1608]
C86  1u  C1608  [1608]
C87  100n  C1005  [1005]
C88  1u  C1608  [1608]
C89  100n  C1608  [1608]
C90  100n  C1608  [1608]
C91  100n  C1608  [1608]
C92  100n  C1608  [1608]
C93  100n  C1608  [1608]
C94  100n  C1608  [1608]
C95  220u  CPOL3.5-8  [E3.5-8]
C98  100u  CPOL2.5-6.3  [E2.5-6.3]
C99  1u  C1608  [1608]
C100  1u  C1608  [1608]
C101  1u  C1608  [1608]
C102  100n  C1005  [1005]
C103  1u  C1608  [1608]
C104  100n  C1608  [1608]
C105  100n  C1608  [1608]
C106  100n  C1608  [1608]
C107  100n  C1608  [1608]
C108  100n  C1608  [1608]
C109  100n  C1608  [1608]
C110  220u  CPOL3.5-8  [E3.5-8]
C113  100u  CPOL2.5-6.3  [E2.5-6.3]
C114  1u  C1608  [1608]
C115  1u  C1608  [1608]
C116  1u  C1608  [1608]
C117  100n  C1005  [1005]
C118  1u  C1608  [1608]
C119  100n  C1608  [1608]
C120  100n  C1608  [1608]
C121  100n  C1608  [1608]
C122  100n  C1608  [1608]
C123  100n  C1608  [1608]
C124  100n  C1608  [1608]
C125  220u  CPOL3.5-8  [E3.5-8]
C128  1u  C1005  [1005]
C129  1u  C1005  [1005]
C130  1u  C1005  [1005]
C131  1u  C1005  [1005]
C132  100n  C1005  [1005]
C133  100n  C1005  [1005]
C140  100n  C1005  [1005]
C141  100n  C1005  [1005]
C149  100u  CPOL2.5-6.3  [E2.5-6.3]
C150  1u  C1608  [1608]
C151  1u  C1608  [1608]
C152  1u  C1608  [1608]
C153  100n  C1005  [1005]
C154  1u  C1608  [1608]
C155  100n  C1608  [1608]
C156  100n  C1608  [1608]
C157  100n  C1608  [1608]
C158  100n  C1608  [1608]
C159  100n  C1608  [1608]
C160  100n  C1608  [1608]
C161  220u  CPOL3.5-8  [E3.5-8]
C163  100n  C1005  [1005]
CN9  EC45FLAT2  [MOTOR_COMPLEX2]
CN10  Motor1  53375-0410  [53375-04]
CN11  EC45FLAT2  [MOTOR_COMPLEX2]
CN12  Motor2  53375-0410  [53375-04]
CN13  EC45FLAT2  [MOTOR_COMPLEX2]
CN14  Motor3  53375-0410  [53375-04]
CN15  EC45FLAT2  [MOTOR_COMPLEX2]
CN16  Motor4  53375-0410  [53375-04]
CN17  Dribble  PIN1X8  [PIN1X8]
R62  33k  R1608  [1608]
R63  1  R1005  [1005]
R66  33k  R1608  [1608]
R67  1  R1005  [1005]
R70  33k  R1608  [1608]
R71  1  R1005  [1005]
R74  33k  R1608  [1608]
R75  1  R1005  [1005]
R78  100k  R1005  [1005]
R79  100k  R1005  [1005]
R80  100k  R1005  [1005]
R81  100k  R1005  [1005]
R82  100k  R1005  [1005]
R83  100k  R1005  [1005]
R84  100k  R1005  [1005]
R85  100k  R1005  [1005]
R86  100k  R1005  [1005]
R87  100k  R1005  [1005]
R88  100k  R1005  [1005]
R89  100k  R1005  [1005]
R90  100k  R1005  [1005]
R91  100k  R1005  [1005]
R92  100k  R1005  [1005]
R93  100k  R1005  [1005]
R94  100k  R1005  [1005]
R95  100k  R1005  [1005]
R96  100k  R1005  [1005]
R97  100k  R1005  [1005]
R98  33k  R1005  [1005]
R99  100k  R1005  [1005]
R104  100k  R1005  [1005]
R105  33k  R1005  [1005]
R110  10k  R1005  [1005]
R111  10k  R1005  [1005]
R112  10k  R1005  [1005]
R113  10k  R1005  [1005]
R117  33k  R1608  [1608]
R118  1  R1005  [1005]
R119  10k  R1005  [1005]
R120  10k  R1005  [1005]
R121  10k  R1005  [1005]
RA2  51  RA4  [1005-A4]
RA3  51  RA4  [1005-A4]
RA4  51  RA4  [1005-A4]
RA5  51  RA4  [1005-A4]
RA6  51  RA4  [1005-A4]
RA7  51  RA4  [1005-A4]
RA8  51  RA4  [1005-A4]
RA9  51  RA4  [1005-A4]
RA10  51  RA4  [1005-A4]
RA11  51  RA4  [1005-A4]
RF3  200m  RF2012  [2012]
RF4  200m  RF2012  [2012]
U14  DRV8332  [HSSOP36]
U17  DRV8332  [HSSOP36]
U20  DRV8332  [HSSOP36]
U23  DRV8332  [HSSOP36]
U26  TC74VHC165FT  [TSSOP16]
U27  TC74VHC165FT  [TSSOP16]
U30  TC74VHC165FT  [TSSOP16]
U31  TC74VHC165FT  [TSSOP16]
U34  FDG6323L  [SC70-6]
U35  FDG6323L  [SC70-6]
U37  DRV8332  [HSSOP36]
U39  MCP9701/LT  [SC70-5]

### Nets
!MOT1_2_DO: U27.7(!QH) ; also sheet 2
!MOT1_2_LATCH: U26.1(S/!L) U27.1(S/!L) ; also sheet 2
!MOT1_FAULT: RA2.B1 ; also sheet 2
!MOT1_HU_5: CN9.1.3(HU) CN9.2.2(HU) R80.2 U26.5(G)
!MOT1_HV_5: CN9.1.4(HV) CN9.2.3(HV) R81.2 U26.6(H)
!MOT1_HW_5: CN9.1.2(HW) CN9.2.4(HW) R82.2 U26.4(F)
!MOT1_OTW: RA2.A1 ; also sheet 2
!MOT1_RESET_A: RA2.D1 ; also sheet 2
!MOT1_RESET_B: RA3.B1 ; also sheet 2
!MOT1_RESET_C: RA3.C1 ; also sheet 2
!MOT2_FAULT: RA4.B1 ; also sheet 2
!MOT2_HU_5: CN11.1.3(HU) CN11.2.2(HU) R85.2 U27.13(C)
!MOT2_HV_5: CN11.1.4(HV) CN11.2.3(HV) R86.2 U27.12(B)
!MOT2_HW_5: CN11.1.2(HW) CN11.2.4(HW) R87.2 U27.14(D)
!MOT2_OTW: RA4.A1 ; also sheet 2
!MOT2_RESET_A: RA4.D1 ; also sheet 2
!MOT2_RESET_B: RA5.B1 ; also sheet 2
!MOT2_RESET_C: RA5.C1 ; also sheet 2
!MOT3_4_5_DO: U31.7(!QH) ; also sheet 2
!MOT3_4_5_LATCH: U30.1(S/!L) U31.1(S/!L) ; also sheet 2
!MOT3_FAULT: RA6.B1 ; also sheet 2
!MOT3_HU_5: CN13.1.3(HU) CN13.2.2(HU) R90.2 U30.5(G)
!MOT3_HV_5: CN13.1.4(HV) CN13.2.3(HV) R91.2 U30.6(H)
!MOT3_HW_5: CN13.1.2(HW) CN13.2.4(HW) R92.2 U30.4(F)
!MOT3_OTW: RA6.A1 ; also sheet 2
!MOT3_RESET_A: RA6.D1 ; also sheet 2
!MOT3_RESET_B: RA7.B1 ; also sheet 2
!MOT3_RESET_C: RA7.C1 ; also sheet 2
!MOT4_FAULT: RA8.B1 ; also sheet 2
!MOT4_HU_5: CN15.1.3(HU) CN15.2.2(HU) R95.2 U31.12(B)
!MOT4_HV_5: CN15.1.4(HV) CN15.2.3(HV) R96.2 U31.11(A)
!MOT4_HW_5: CN15.1.2(HW) CN15.2.4(HW) R97.2 U31.13(C)
!MOT4_OTW: RA8.A1 ; also sheet 2
!MOT4_RESET_A: RA8.D1 ; also sheet 2
!MOT4_RESET_B: RA9.B1 ; also sheet 2
!MOT4_RESET_C: RA9.C1 ; also sheet 2
!MOT5_FAULT: RA10.B1 ; also sheet 2
!MOT5_HU_5: CN17.6 R119.1 U31.5(G)
!MOT5_HV_5: CN17.7 R120.1 U31.6(H)
!MOT5_HW_5: CN17.8 R121.1 U31.14(D)
!MOT5_OTW: RA10.A1 ; also sheet 2
!MOT5_RESET_A: RA10.D1 ; also sheet 2
!MOT5_RESET_B: RA11.B1 ; also sheet 2
!MOT5_RESET_C: RA11.C1 ; also sheet 2
+3V3: C132.1 C133.1 C140.1 C141.1 C163.1 U26.16(VCC) U27.16(VCC) U30.16(VCC) U31.16(VCC) U39.4(VDD) ; also sheet 1,2
+5V: R111.2 R113.2 U34.4(IN) U35.4(IN) ; also sheet 1,2
+5V/2: C128.1 C129.1 CN9.1.1(VCC) CN9.2.8(VCC) CN10.4 CN11.1.1(VCC) CN11.2.8(VCC) CN12.4 RF3.1
+5V/3: C130.1 C131.1 CN13.1.1(VCC) CN13.2.8(VCC) CN14.4 CN15.1.1(VCC) CN15.2.8(VCC) CN16.4 CN17.4 R119.2 R120.2 R121.2 RF4.1
+12V: C68.P C69.1 C70.1 C71.1 C73.1 C83.P C84.1 C85.1 C86.1 C88.1 C98.P C99.1 C100.1 C101.1 C103.1 C113.P C114.1 C115.1 C116.1 C118.1 C149.P C150.1 C151.1 C152.1 C154.1 U14.1(GVDD_B) U14.17(VDD) U14.18(GVDD_C) U14.19(GVDD_C) U14.36(GVDD_A) U17.1(GVDD_B) U17.17(VDD) U17.18(GVDD_C) U17.19(GVDD_C) U17.36(GVDD_A) U20.1(GVDD_B) U20.17(VDD) U20.18(GVDD_C) U20.19(GVDD_C) U20.36(GVDD_A) U23.1(GVDD_B) U23.17(VDD) U23.18(GVDD_C) U23.19(GVDD_C) U23.36(GVDD_A) U37.1(GVDD_B) U37.17(VDD) U37.18(GVDD_C) U37.19(GVDD_C) U37.36(GVDD_A) ; also sheet 1
GND: C68.N C69.2 C70.2 C71.2 C73.2 C77.2 C78.2 C79.2 C80.N C83.N C84.2 C85.2 C86.2 C88.2 C92.2 C93.2 C94.2 C95.N C98.N C99.2 C100.2 C101.2 C103.2 C107.2 C108.2 C109.2 C110.N C113.N C114.2 C115.2 C116.2 C118.2 C122.2 C123.2 C124.2 C125.N C128.2 C129.2 C130.2 C131.2 C132.2 C133.2 C140.2 C141.2 C149.N C150.2 C151.2 C152.2 C154.2 C158.2 C159.2 C160.2 C161.N C163.2 CN9.1.5(GND) CN9.2.1(GND) CN9.S1 CN9.S2 CN10.2 CN11.1.5(GND) CN11.2.1(GND) CN11.S1 CN11.S2 CN12.2 CN13.1.5(GND) CN13.2.1(GND) CN13.S1 CN13.S2 CN14.2 CN15.1.5(GND) CN15.2.1(GND) CN15.S1 CN15.S2 CN16.2 CN17.5 R63.1 R67.1 R71.1 R75.1 R78.1 R79.1 R80.1 R81.1 R82.1 R83.1 R84.1 R85.1 R86.1 R87.1 R88.1 R89.1 R90.1 R91.1 R92.1 R93.1 R94.1 R95.1 R96.1 R97.1 R98.1 R105.1 R110.1 R112.1 R118.1 U14.8(GND) U14.23(GND_C) U14.24(GND) U14.25(GND) U14.31(GND_B) U14.32(GND_A) U17.8(GND) U17.23(GND_C) U17.24(GND) U17.25(GND) U17.31(GND_B) U17.32(GND_A) U20.8(GND) U20.23(GND_C) U20.24(GND) U20.25(GND) U20.31(GND_B) U20.32(GND_A) U23.8(GND) U23.23(GND_C) U23.24(GND) U23.25(GND) U23.31(GND_B) U23.32(GND_A) U26.3(E) U26.8(GND) U26.10(SI) U26.13(C) U26.14(D) U26.15(CKINH) U27.5(G) U27.6(H) U27.8(GND) U27.15(CKINH) U30.8(GND) U30.10(SI) U30.13(C) U30.14(D) U30.15(CKINH) U31.8(GND) U31.15(CKINH) U34.1(R2) U35.1(R2) U37.8(GND) U37.23(GND_C) U37.24(GND) U37.25(GND) U37.31(GND_B) U37.32(GND_A) U39.2(GND) ; also sheet 1,2
MOT1_2_CLK: U26.2(CK) U27.2(CK) ; also sheet 2
MOT1_2_EN_SENSOR: R110.2 U34.5(EN) ; also sheet 2
MOT1_A_5: CN10.3 R78.2 U26.12(B)
MOT1_B_5: CN10.1 R79.2 U26.11(A)
MOT1_GND: C72.2 R62.1 R63.2 U14.9(AGND) U14.12(M2)
MOT1_OUT_U: C74.2 CN9.1.10(U) CN9.1.11(U) CN9.2.5(U) U14.33(OUT_A)
MOT1_OUT_V: C75.2 CN9.1.8(V) CN9.1.9(V) CN9.2.6(V) U14.30(OUT_B)
MOT1_OUT_W: C76.2 CN9.1.6(W) CN9.1.7(W) CN9.2.7(W) U14.22(OUT_C)
MOT1_PWM_A: RA2.C1 ; also sheet 2
MOT1_PWM_B: RA3.A1 ; also sheet 2
MOT1_PWM_C: RA3.D1 ; also sheet 2
MOT2_A_5: CN12.3 R83.2 U27.4(F)
MOT2_B_5: CN12.1 R84.2 U27.3(E)
MOT2_GND: C87.2 R66.1 R67.2 U17.9(AGND) U17.12(M2)
MOT2_OUT_U: C89.2 CN11.1.10(U) CN11.1.11(U) CN11.2.5(U) U17.33(OUT_A)
MOT2_OUT_V: C90.2 CN11.1.8(V) CN11.1.9(V) CN11.2.6(V) U17.30(OUT_B)
MOT2_OUT_W: C91.2 CN11.1.6(W) CN11.1.7(W) CN11.2.7(W) U17.22(OUT_C)
MOT2_PWM_A: RA4.C1 ; also sheet 2
MOT2_PWM_B: RA5.A1 ; also sheet 2
MOT2_PWM_C: RA5.D1 ; also sheet 2
MOT2_TEMP: U39.3(VOUT) ; also sheet 2
MOT3_4_5_CLK: U30.2(CK) U31.2(CK) ; also sheet 2
MOT3_4_5_EN_SENSOR: R112.2 U35.5(EN) ; also sheet 2
MOT3_A_5: CN14.3 R88.2 U30.12(B)
MOT3_B_5: CN14.1 R89.2 U30.11(A)
MOT3_GND: C102.2 R70.1 R71.2 U20.9(AGND) U20.12(M2)
MOT3_OUT_U: C104.2 CN13.1.10(U) CN13.1.11(U) CN13.2.5(U) U20.33(OUT_A)
MOT3_OUT_V: C105.2 CN13.1.8(V) CN13.1.9(V) CN13.2.6(V) U20.30(OUT_B)
MOT3_OUT_W: C106.2 CN13.1.6(W) CN13.1.7(W) CN13.2.7(W) U20.22(OUT_C)
MOT3_PWM_A: RA6.C1 ; also sheet 2
MOT3_PWM_B: RA7.A1 ; also sheet 2
MOT3_PWM_C: RA7.D1 ; also sheet 2
MOT4_A_5: CN16.3 R93.2 U31.4(F)
MOT4_B_5: CN16.1 R94.2 U31.3(E)
MOT4_GND: C117.2 R74.1 R75.2 U23.9(AGND) U23.12(M2)
MOT4_OUT_U: C119.2 CN15.1.10(U) CN15.1.11(U) CN15.2.5(U) U23.33(OUT_A)
MOT4_OUT_V: C120.2 CN15.1.8(V) CN15.1.9(V) CN15.2.6(V) U23.30(OUT_B)
MOT4_OUT_W: C121.2 CN15.1.6(W) CN15.1.7(W) CN15.2.7(W) U23.22(OUT_C)
MOT4_PWM_A: RA8.C1 ; also sheet 2
MOT4_PWM_B: RA9.A1 ; also sheet 2
MOT4_PWM_C: RA9.D1 ; also sheet 2
MOT5_GND: C153.2 R117.1 R118.2 U37.9(AGND) U37.12(M2)
MOT5_OUT_U: C155.2 CN17.1 U37.33(OUT_A)
MOT5_OUT_V: C156.2 CN17.2 U37.30(OUT_B)
MOT5_OUT_W: C157.2 CN17.3 U37.22(OUT_C)
MOT5_PWM_A: RA10.C1 ; also sheet 2
MOT5_PWM_B: RA11.A1 ; also sheet 2
MOT5_PWM_C: RA11.D1 ; also sheet 2
N$20: R98.2 R99.1 U27.11(A)
N$27: R62.2 U14.7(OC_ADJ)
N$28: C74.1 U14.35(BST_A)
N$43: R104.2 R105.2 U30.3(E)
N$58: R70.2 U20.7(OC_ADJ)
N$59: C75.1 U14.28(BST_B)
N$61: C76.1 U14.20(BST_C)
N$62: C72.1 U14.10(VREG) U14.11(M3) U14.13(M1)
N$64: R66.2 U17.7(OC_ADJ)
N$65: C89.1 U17.35(BST_A)
N$66: C90.1 U17.28(BST_B)
N$68: C91.1 U17.20(BST_C)
N$69: C87.1 U17.10(VREG) U17.11(M3) U17.13(M1)
N$73: RA3.C2 U14.15(!RESET_C)
N$74: RA3.B2 U14.14(!RESET_B)
N$75: RA2.D2 U14.5(!RESET_A)
N$76: RA3.D2 U14.16(PWM_C)
N$77: RA3.A2 U14.6(PWM_B)
N$78: RA2.C2 U14.4(PWM_A)
N$79: RA2.B2 U14.3(!FAULT)
N$80: RA2.A2 U14.2(!OTW)
N$81: RA4.A2 U17.2(!OTW)
N$82: RA4.B2 U17.3(!FAULT)
N$83: RA4.C2 U17.4(PWM_A)
N$84: RA5.A2 U17.6(PWM_B)
N$85: RA5.D2 U17.16(PWM_C)
N$86: RA4.D2 U17.5(!RESET_A)
N$87: RA5.B2 U17.14(!RESET_B)
N$88: RA5.C2 U17.15(!RESET_C)
N$91: C104.1 U20.35(BST_A)
N$92: C105.1 U20.28(BST_B)
N$94: C106.1 U20.20(BST_C)
N$95: C102.1 U20.10(VREG) U20.11(M3) U20.13(M1)
N$96: RA6.A2 U20.2(!OTW)
N$97: RA6.B2 U20.3(!FAULT)
N$98: RA6.C2 U20.4(PWM_A)
N$99: RA7.A2 U20.6(PWM_B)
N$100: RA7.D2 U20.16(PWM_C)
N$101: RA6.D2 U20.5(!RESET_A)
N$102: RA7.B2 U20.14(!RESET_B)
N$103: RA7.C2 U20.15(!RESET_C)
N$105: R74.2 U23.7(OC_ADJ)
N$106: C119.1 U23.35(BST_A)
N$107: C120.1 U23.28(BST_B)
N$109: C121.1 U23.20(BST_C)
N$110: C117.1 U23.10(VREG) U23.11(M3) U23.13(M1)
N$111: RA8.A2 U23.2(!OTW)
N$112: RA8.B2 U23.3(!FAULT)
N$113: RA8.C2 U23.4(PWM_A)
N$114: RA9.A2 U23.6(PWM_B)
N$115: RA9.D2 U23.16(PWM_C)
N$116: RA8.D2 U23.5(!RESET_A)
N$117: RA9.B2 U23.14(!RESET_B)
N$118: RA9.C2 U23.15(!RESET_C)
N$120: R117.2 U37.7(OC_ADJ)
N$121: C155.1 U37.35(BST_A)
N$122: C156.1 U37.28(BST_B)
N$124: C157.1 U37.20(BST_C)
N$125: C153.1 U37.10(VREG) U37.11(M3) U37.13(M1)
N$126: RA11.C2 U37.15(!RESET_C)
N$127: RA11.B2 U37.14(!RESET_B)
N$128: RA10.D2 U37.5(!RESET_A)
N$129: RA11.D2 U37.16(PWM_C)
N$130: RA11.A2 U37.6(PWM_B)
N$131: RA10.C2 U37.4(PWM_A)
N$132: RA10.B2 U37.3(!FAULT)
N$133: RA10.A2 U37.2(!OTW)
N$136: U26.9(QH) U27.10(SI)
N$137: U30.9(QH) U31.10(SI)
N$142: RF3.2 U34.2(OUT) U34.3(OUT)
N$143: RF4.2 U35.2(OUT) U35.3(OUT)
N$144: R111.1 U34.6(R1)
N$145: R113.1 U35.6(R1)
VCC/1: C77.1 C78.1 C79.1 C80.P C92.1 C93.1 C94.1 C95.P R99.2 U14.21(PVDD_C) U14.29(PVDD_B) U14.34(PVDD_A) U17.21(PVDD_C) U17.29(PVDD_B) U17.34(PVDD_A) ; also sheet 1
VCC/2: C107.1 C108.1 C109.1 C110.P C122.1 C123.1 C124.1 C125.P C158.1 C159.1 C160.1 C161.P R104.1 U20.21(PVDD_C) U20.29(PVDD_B) U20.34(PVDD_A) U23.21(PVDD_C) U23.29(PVDD_B) U23.34(PVDD_A) U37.21(PVDD_C) U37.29(PVDD_B) U37.34(PVDD_A) ; also sheet 1
Unconnected: U26.7(!QH) U27.9(QH) U30.7(!QH) U31.9(QH)

### Notes on the sheet
- KIKS2013 | Date | Schemed by
- Gen.5's Base Board | 2013/11/12 | FUJII NAOMICHI

## Library data of the parts
BZ1 = Speaker:PKLCS1212E*
C2 C5 C6 C8-C23 C25-C35 C37-C41 C43-C54 C57 C59 C61 C64-C67 C69-C79 C84-C94 C99-C109 C114-C124 C128-C133 C140 C141 C150-C160 C163 C166 C167 = Passive:C
C3 C4 C7 C68 C80 C83 C95 C98 C110 C113 C125 C149 C161 = Passive:CPOL
C55 C56 C58 C60 C62 = Filter:CT
CN1 = Connector:T-CON
CN2 = con-Molex:43045-0800
CN3 = con-Hirose:UX60S
CN4 = Connector:CN-JTAG_ALTERA
CN5 = con-Molex:70553-0003
CN6 CN17 = Connector:PIN1X8
CN7 = Connector:XBEE-*
CN8 CN10 CN12 CN14 CN16 = con-Molex:53375-0410
CN9 CN11 CN13 CN15 = ProjectOnly:EC45FLAT
CN18 = Connector:PIN2X4
D1 D2 D4 = Diode:ZENER-*
D3 D5-D8 = Diode:SBD-*
F1-F3 = Passive:F
FB1 = Passive:FB
J1 = Connector:PIN2X5-2.0
L1-L5 = Passive:L
LED1-LED10 = Opto:LED
LOGO1 = ProjectOnly:LOGO-876_SMALL
P1-P4 = ic-package:PAD
Q1 Q2 = Transistor:MOS-N-*
Q3 Q4 = Transistor:MOS-P-*
R4-R42 R44-R63 R66 R67 R70 R71 R74 R75 R78-R99 R104 R105 R110-R113 R117-R123 = Passive:R
RA1-RA11 = Passive:RA4
RF1-RF4 = Passive:RF
SW1 = Switch:SLE*A4
SW2 SW3 = Switch:EVQ-?
U2 = ic-LT:LT3504
U3 = ic-Exar:SPX3819-*
U4 = ic-TI:TPD2S017
U5 = ic-ATMEL:AT32UC3B0512
U7 = ic-Macronix:MX25L6445E
U8 U10 = ic-TI:1G08
U9 = ic-Xilinx:XC6SLX9-TQ144
U11 = ic-Toshiba:TC74VHC164F
U12 U34 U35 = ic-Fairchild:FDG6323L
U13 = ProjectOnly:AE-NJU72501
U14 U17 U20 U23 U37 = ic-TI:DRV8332
U26 U27 U30 U31 = ic-Toshiba:TC74VHC165F
U39 = ic-Microchip:MCP970*
VR1 = Passive:VR
X1 = Oscillator:ASDM